# EAGLE design AdelinoR2 (EAGLE 9.2.2)
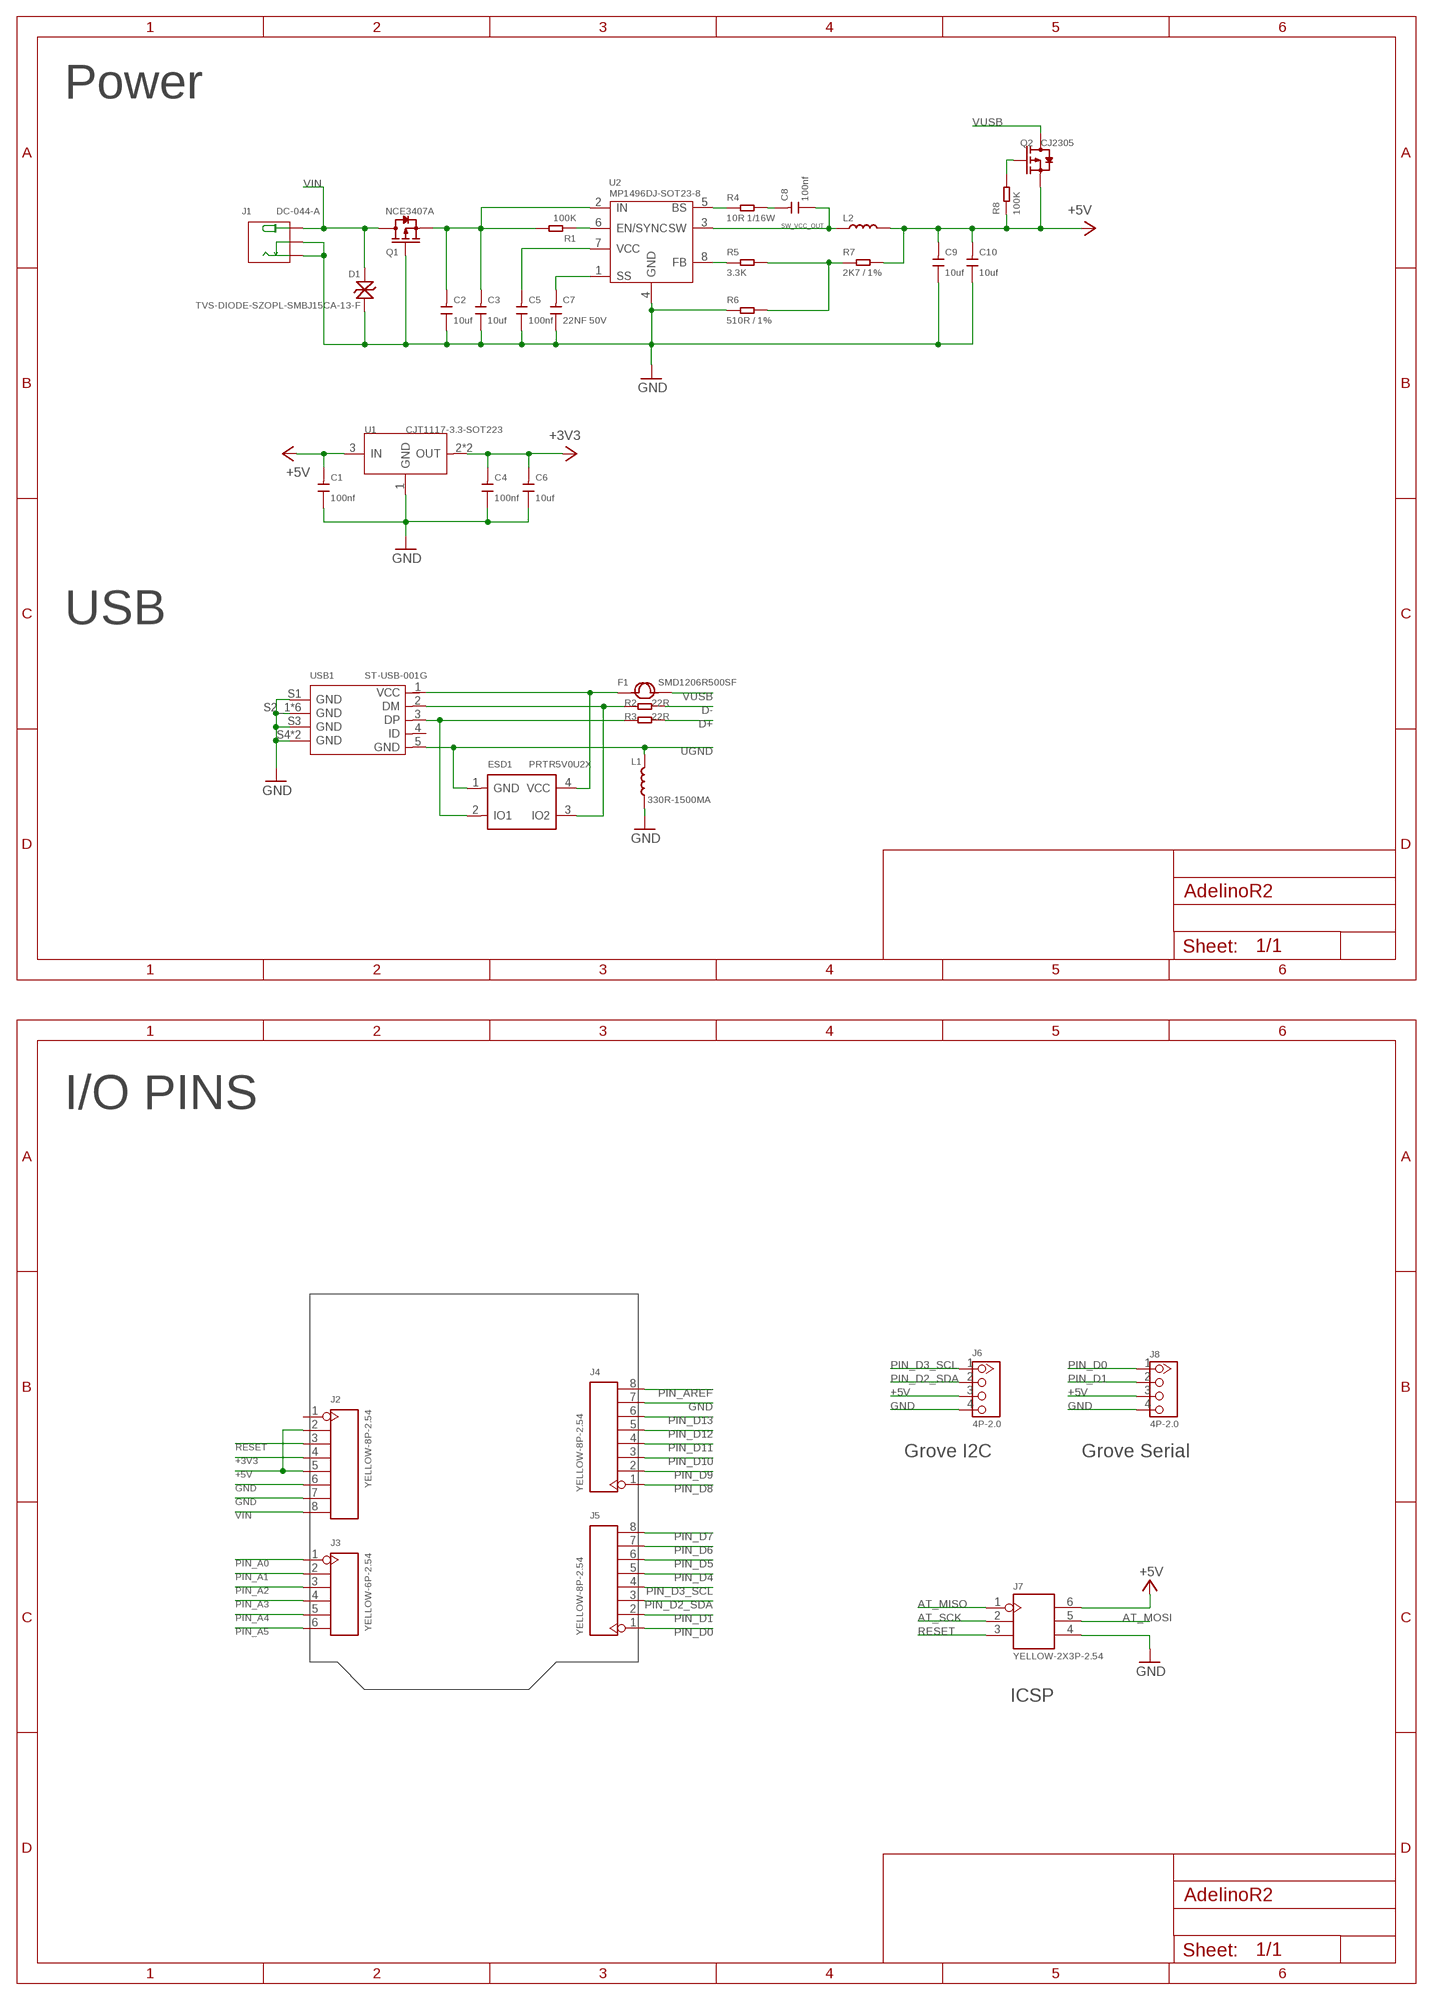
[diagram p0: schematic, sheet 1, part 1 of 2]
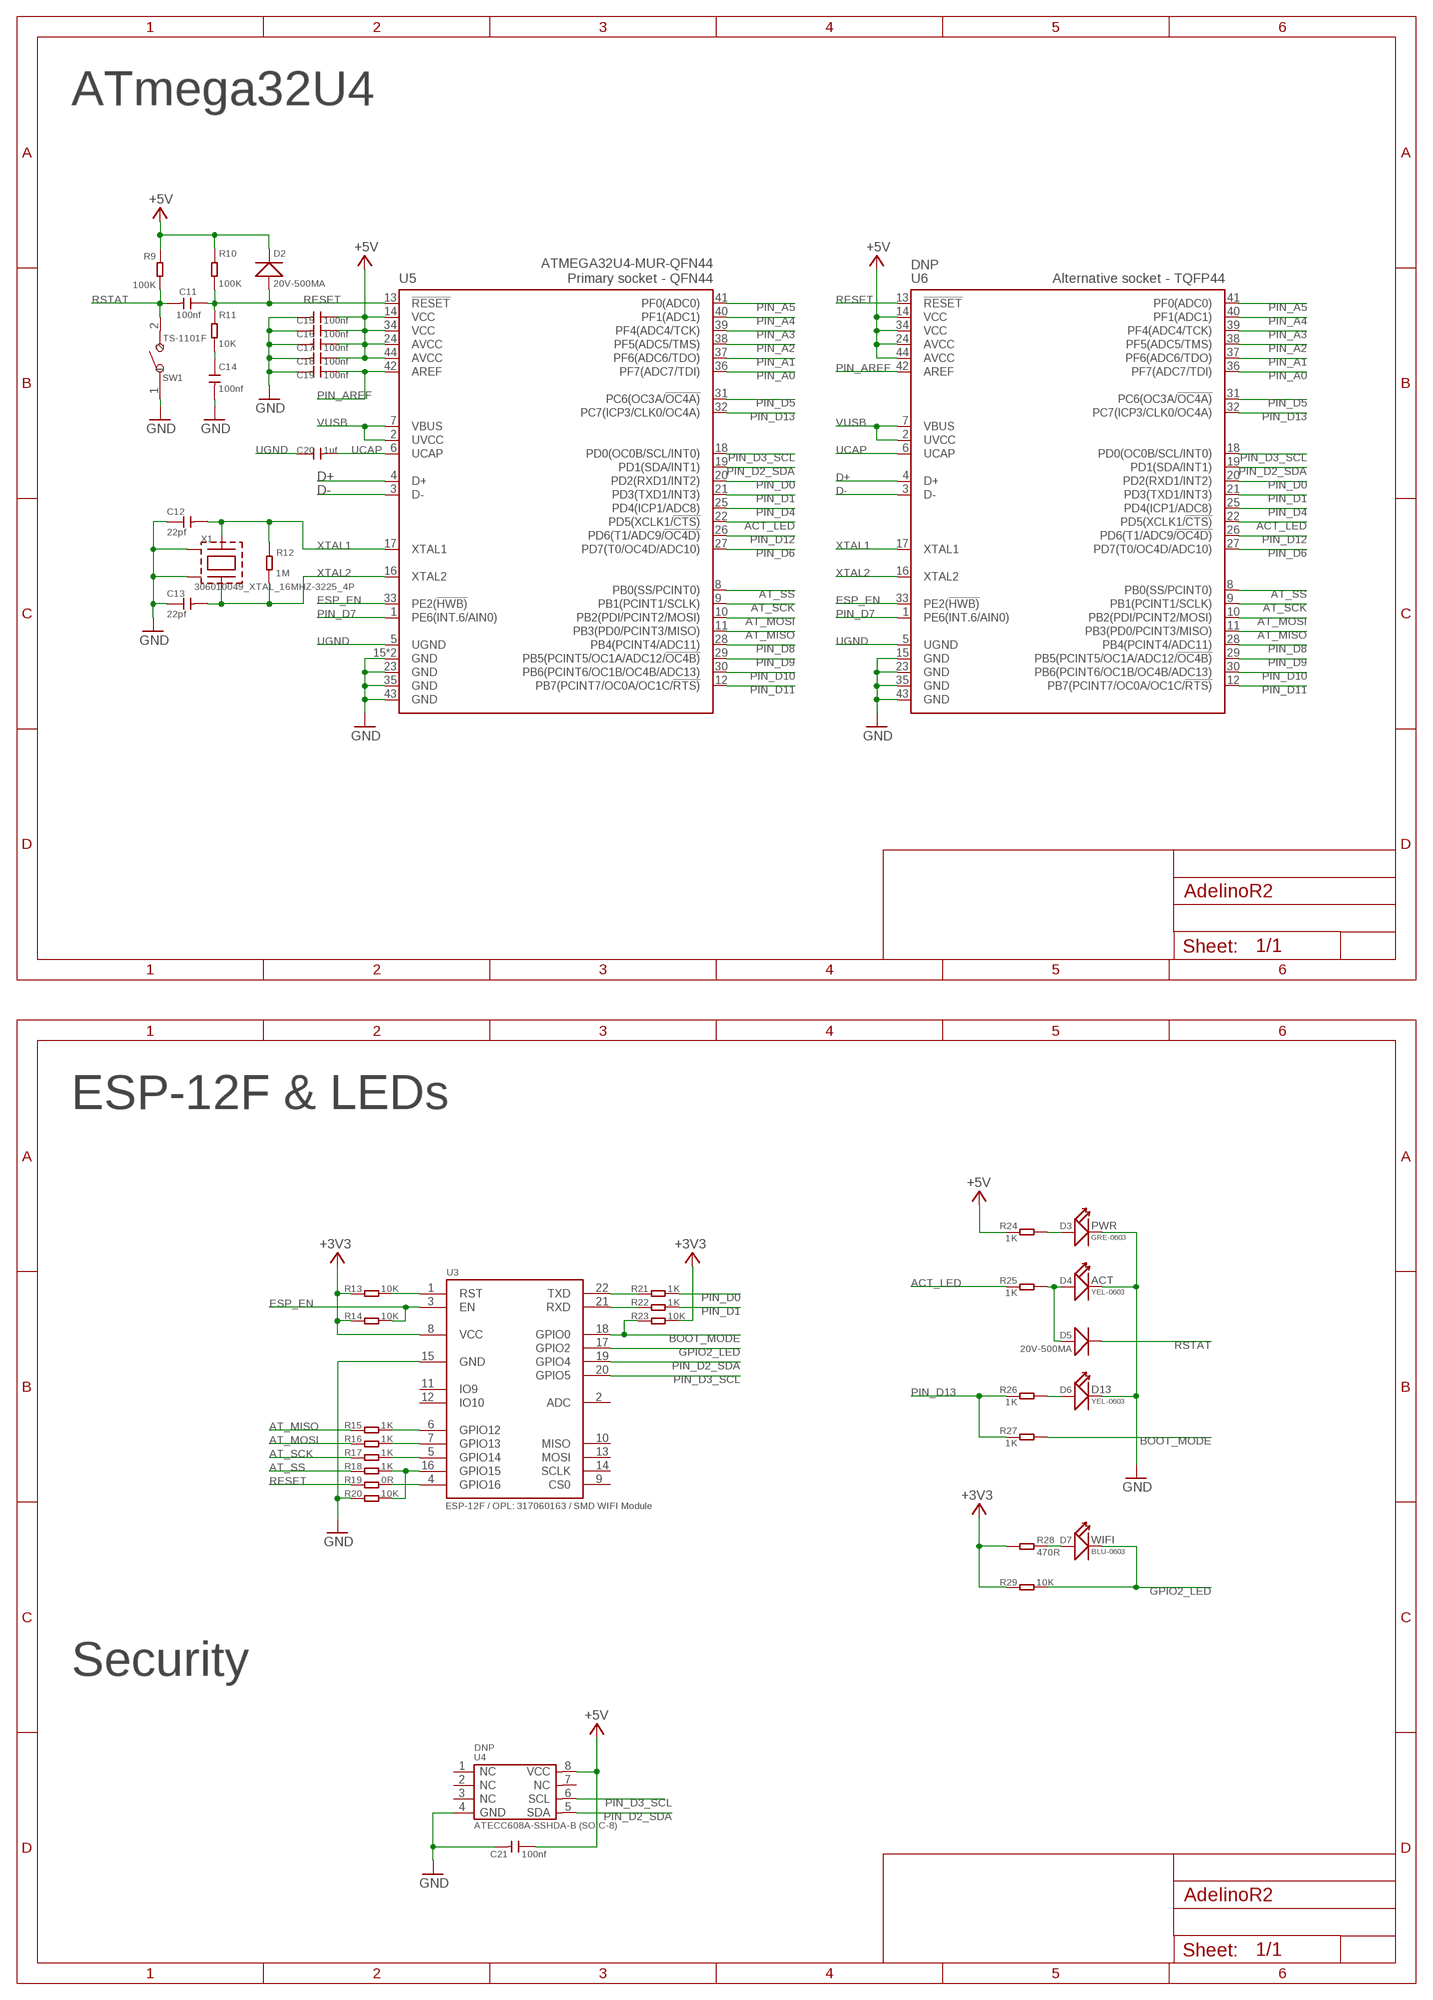
[diagram p1: schematic, sheet 1, part 2 of 2]

## Parts
C1  100nf  CERAMIC-100NF-25V-10%-X7R(0402)  [C0402]
C2  10uf  CERAMIC-10UF-25V-10%-X5R(0805)  [C0805]
C3  10uf  CERAMIC-10UF-25V-10%-X5R(0805)  [C0805]
C4  100nf  CERAMIC-100NF-25V-10%-X7R(0402)  [C0402]
C5  100nf  CERAMIC-100NF-25V-10%-X7R(0402)  [C0402]
C6  10uf  CERAMIC-10UF-25V-10%-X5R(0805)  [C0805]
C7  22NF 50V  CERAMIC-22NF-50V-10%-X7R(0402)  [C0402]
C8  100nf  CERAMIC-100NF-25V-10%-X7R(0402)  [C0402]
C9  10uf  CERAMIC-10UF-25V-10%-X5R(0805)  [C0805]
C10  10uf  CERAMIC-10UF-25V-10%-X5R(0805)  [C0805]
C11  100nf  CERAMIC-100NF-25V-10%-X7R(0402)  [C0402]
C12  22pf  CERAMIC-22PF-50V-5%-NPO(0402)  [C0402]
C13  22pf  CERAMIC-22PF-50V-5%-NPO(0402)  [C0402]
C14  100nf  CERAMIC-100NF-25V-10%-X7R(0402)  [C0402]
C15  100nf  CERAMIC-100NF-25V-10%-X7R(0402)  [C0402]
C16  100nf  CERAMIC-100NF-25V-10%-X7R(0402)  [C0402]
C17  100nf  CERAMIC-100NF-25V-10%-X7R(0402)  [C0402]
C18  100nf  CERAMIC-100NF-25V-10%-X7R(0402)  [C0402]
C19  100nf  CERAMIC-100NF-25V-10%-X7R(0402)  [C0402]
C20  1uf  CERAMIC-1UF-25V-10%-X7R(0805)  [C0805]
C21  100nf  CERAMIC-100NF-25V-10%-X7R(0402)  [C0402]
D1  TVS-DIODE-SZOPL-SMBJ15CA-13-F  [DO-214AA]
D2  20V-500MA  SMD-DIODE-SCHOTTKY-20V-500MA(SOD-123)P  [SOD-123]
D3  GRE-0603  SMD-LED-CLEAR-GREEN(0603)  [LED-0603]
D4  YEL-0603  SMD-LED-CLEAR-YELLOW(0603)  [LED-0603]
D5  20V-500MA  SMD-DIODE-SCHOTTKY-20V-500MA(SOD-123)P  [SOD-123]
D6  YEL-0603  SMD-LED-CLEAR-YELLOW(0603)  [LED-0603]
D7  BLU-0603  SMD-LED-CLEAR-BLUE(0603)  [LED-0603]
ESD1  PRTR5V0U2X  SMD-DIODE-TVS-5.5V  [SOT-143B]
F1  SMD1206R500SF  SMD-PPTC-500MA(1206)  [F1206]
J1  DC-044-A  JACK-DC-044-A  [DCJ3P-11.6X9.6X7.0MM]
J2  YELLOW-8P-2.54  DIP-YELLOW-FEMALE-HEADER(8P-2.54)  [H8-2.54]
J3  YELLOW-6P-2.54  DIP-YELLOW-FEMALE-HEADER-VERT(6P-2.54)  [H6-2.54]
J4  YELLOW-8P-2.54  DIP-YELLOW-FEMALE-HEADER(8P-2.54)  [H8-2.54]
J5  YELLOW-8P-2.54  DIP-YELLOW-FEMALE-HEADER(8P-2.54)  [H8-2.54]
J6  4P-2.0  GROVE-CONNECTOR-DIP(4P-2.0)  [HW4-2.0]
J7  YELLOW-2X3P-2.54  DIP-YELLOW-MALE-HEADER-VERT(2X3P-2.54)  [H2X3-2.54]
J8  4P-2.0  GROVE-CONNECTOR-DIP(4P-2.0)  [HW4-2.0]
L1  330R-1500MA  SMD-FERRITE-BEAD-330R-1500MA(0805)'0805'  [L0805]
L2  10UH-225MA  SMD-INDUCTOR-10UH-20%-2.35A(2P-5X5X4MM)  [L5040S]
Q1  NCE3407A  SMD-MOSFET-P-CH-VDC=30V-ID=4.3A-NCE3407A(SOT-23)  [SOT-23]
Q2  CJ2305  SMD-MOSFET-P-CH-8V-4.1A-CJ2305(SOT-23)  [SOT-23]
R1  100K  SMD-RES-100K-1%-1/16W(0402)  [R0402]
R2  22R  SMD-RES-22R-1%-1/16W(0402)  [R0402]
R3  22R  SMD-RES-22R-1%-1/16W(0402)  [R0402]
R4  10R 1/16W  SMD-RES-10R-1%-1/16W(0402)  [R0402]
R5  3.3K  SMD-RES-3.3K-5%-1/16W(0402)  [R0402]
R6  3K / 1%  SMD-RES-510R-1%-1/10W(0603)  [R0603]
R7  2K7 / 1%  SMD-RES-2.7K-1%-1/10W(0603)  [R0603]
R8  100K  SMD-RES-100K-1%-1/16W(0402)  [R0402]
R9  100K  SMD-RES-100K-1%-1/16W(0402)  [R0402]
R10  100K  SMD-RES-100K-1%-1/16W(0402)  [R0402]
R11  10K  SMD-RES-10K-1%-1/16W(0402)  [R0402]
R12  1M  SMD-RES-1M-1%-1/16W(0402)  [R0402]
R13  10K  SMD-RES-10K-1%-1/16W(0402)  [R0402]
R14  10K  SMD-RES-10K-1%-1/16W(0402)  [R0402]
R15  1K  SMD-RES-1K-5%-1/16W(0402)  [R0402]
R16  1K  SMD-RES-1K-5%-1/16W(0402)  [R0402]
R17  1K  SMD-RES-1K-5%-1/16W(0402)  [R0402]
R18  1K  SMD-RES-1K-5%-1/16W(0402)  [R0402]
R19  0R  SMD-RES-0R-5%-1/16W(0402)  [R0402]
R20  10K  SMD-RES-10K-1%-1/16W(0402)  [R0402]
R21  1K  SMD-RES-1K-5%-1/16W(0402)  [R0402]
R22  1K  SMD-RES-1K-5%-1/16W(0402)  [R0402]
R23  10K  SMD-RES-10K-1%-1/16W(0402)  [R0402]
R24  1K  SMD-RES-1K-5%-1/16W(0402)  [R0402]
R25  1K  SMD-RES-1K-5%-1/16W(0402)  [R0402]
R26  1K  SMD-RES-1K-5%-1/16W(0402)  [R0402]
R27  1K  SMD-RES-1K-5%-1/16W(0402)  [R0402]
R28  470R  SMD-RES-470R-5%-1/16W(0402)  [R0402]
R29  10K  SMD-RES-10K-1%-1/16W(0402)  [R0402]
SW1  TS-1101F  DIP-BUTTON(2P-6.0X3.0X4.3MM)-TS-1101F  [SW2-5.0-6.0X3.0X4.3MM]
U1  CJT1117-3.3-SOT223  PMIC-CJT1117-3.3(SOT223)  [SOT-223]
U2  MP1496DJ-SOT23-8  PMIC-MP1496DJ(SOT23-8)  [SOT-23-8]
U3  ESP-12F / OPL: 317060163 / SMD WIFI Module  ESP-12F  [ESP-12F]
U4  DNP  ATECC608(SOIC8)  [SOIC8-1.27-5X4MM]
U5  ATMEGA32U4-MUR-QFN44  MCU-ATMEGA32U4-MUR(VQFN44)  [QFN44G-0.5-7X7MM]
U6  DNP  MCU-ATMEGA32U4-AU(TQFP44)  [TQFP44-0.8-9.6X9.6MM]
USB1  ST-USB-001G  MICRO-USB-SMD-B-WITHOUT-POST-W/P(ST-USB-001G)  [MICRO-USB5+4P-SMD-0.65-B]
X1  306010049_XTAL_16MHZ-3225_4P  [X3225_4P]

## Nets
+3V3: C4.2 C6.2 J2.4 R13.1 R14.1 R23.2 R28.1 R29.1 U1.2(OUT) U1.TER(OUT) U3.8(VCC)
+5V: C1.2 C9.2 C10.2 C15.1 C16.1 C17.1 C18.1 C21.1 D2.- J2.2 J2.5 J6.3 J7.6 J8.3 L2.2 Q2.2(S) R7.2 R8.1 R9.1 R10.2 R24.1 U1.3(IN) U4.8(VCC) U5.14(VCC) U5.24(AVCC) U5.34(VCC) U5.44(AVCC) U6.14(VCC) U6.24(AVCC) U6.34(VCC) U6.44(AVCC)
_ACT: D4.+ D5.+ R25.2
_D13: D6.+ R26.2
_PWR: D3.+ R24.2
ACT_LED: R25.1 U5.22(PD5(XCLK1/!CTS)) U6.22(PD5(XCLK1/!CTS))
AT_MISO: J7.1 R15.1 U5.11(PB3(PD0/PCINT3/MISO)) U6.11(PB3(PD0/PCINT3/MISO))
AT_MOSI: J7.5 R16.1 U5.10(PB2(PDI/PCINT2/MOSI)) U6.10(PB2(PDI/PCINT2/MOSI))
AT_SCK: J7.2 R17.1 U5.9(PB1(PCINT1/SCLK)) U6.9(PB1(PCINT1/SCLK))
AT_SS: R18.1 U5.8(PB0(SS/PCINT0)) U6.8(PB0(SS/PCINT0))
BOOT_MODE: R23.1 R27.2 U3.18(GPIO0)
D+: R3.2 U5.4(D+) U6.4(D+)
D-: R2.2 U5.3(D-) U6.3(D-)
ESP_EN: R14.2 U3.3(EN) U5.33(PE2(!HWB)) U6.33(PE2(!HWB))
GND: C1.1 C2.1 C3.1 C4.1 C5.1 C6.1 C7.1 C9.1 C10.1 C12.1 C13.1 C14.2 C15.2 C16.2 C17.2 C18.2 C19.2 C21.2 D1.+ D3.- D4.- D6.- J1.CDN1(CDN) J1.CDN2(CDN) J1.CDN3(CDN) J1.CDN4(CDN) J1.GND1(-) J1.GND2(-) J1.GND3(-) J1.GND4(-) J2.6 J2.7 J4.7 J6.4 J7.4 J8.4 L1.1 Q1.1(G) R6.1 R20.1 SW1.1 U1.1(GND) U2.4(GND) U3.15(GND) U4.4(GND) U5.15(GND) U5.23(GND) U5.35(GND) U5.43(GND) U5.TAB(GND) U6.15(GND) U6.23(GND) U6.35(GND) U6.43(GND) USB1.S1(GND) USB1.S2_1(GND) USB1.S2_2(GND) USB1.S2_3(GND) USB1.S3(GND) USB1.S4(GND) USB1.S5_1(GND) USB1.S5_2(GND) USB1.S5_3(GND) USB1.S6(GND) X1.P$2(GND1) X1.P$4(GND2)
GPIO2_LED: D7.- R29.2 U3.17(GPIO2)
N$1 [usb]: ESD1.3(IO2) R2.1 USB1.2(DM)
N$2 [usb]: ESD1.2(IO1) R3.1 USB1.3(DP)
N$3: Q2.1(G) R8.2
N$4: D7.+ R28.2
N$5: R19.2 U3.4(GPIO16)
N$9: ESD1.4(VCC) F1.1 USB1.1(VCC)
N$12: R15.2 U3.6(GPIO12)
N$13: C14.1 R11.2
N$14: R16.2 U3.7(GPIO13)
N$15: C8.2 R4.2
N$17: R21.1 U3.22(TXD)
N$18: R22.1 U3.21(RXD)
N$19: R17.2 U3.5(GPIO14)
N$20: R18.2 R20.2 U3.16(GPIO15)
N$22: R13.2 U3.1(RST)
N$23: R5.2 R6.2 R7.1
PIN_A0: J3.1 U5.36(PF7(ADC7/TDI)) U6.36(PF7(ADC7/TDI))
PIN_A1: J3.2 U5.37(PF6(ADC6/TDO)) U6.37(PF6(ADC6/TDO))
PIN_A2: J3.3 U5.38(PF5(ADC5/TMS)) U6.38(PF5(ADC5/TMS))
PIN_A3: J3.4 U5.39(PF4(ADC4/TCK)) U6.39(PF4(ADC4/TCK))
PIN_A4: J3.5 U5.40(PF1(ADC1)) U6.40(PF1(ADC1))
PIN_A5: J3.6 U5.41(PF0(ADC0)) U6.41(PF0(ADC0))
PIN_AREF: C19.1 J4.8 U5.42(AREF) U6.42(AREF)
PIN_D0: J5.1 J8.1 R21.2 U5.20(PD2(RXD1/INT2)) U6.20(PD2(RXD1/INT2))
PIN_D1: J5.2 J8.2 R22.2 U5.21(PD3(TXD1/INT3)) U6.21(PD3(TXD1/INT3))
PIN_D2_SDA: J5.3 J6.2 U3.19(GPIO4) U4.5(SDA) U5.19(PD1(SDA/INT1)) U6.19(PD1(SDA/INT1))
PIN_D3_SCL: J5.4 J6.1 U3.20(GPIO5) U4.6(SCL) U5.18(PD0(OC0B/SCL/INT0)) U6.18(PD0(OC0B/SCL/INT0))
PIN_D4: J5.5 U5.25(PD4(ICP1/ADC8)) U6.25(PD4(ICP1/ADC8))
PIN_D5: J5.6 U5.31(PC6(OC3A/!OC4A)) U6.31(PC6(OC3A/!OC4A))
PIN_D6: J5.7 U5.27(PD7(T0/OC4D/ADC10)) U6.27(PD7(T0/OC4D/ADC10))
PIN_D7: J5.8 U5.1(PE6(INT.6/AIN0)) U6.1(PE6(INT.6/AIN0))
PIN_D8: J4.1 U5.28(PB4(PCINT4/ADC11)) U6.28(PB4(PCINT4/ADC11))
PIN_D9: J4.2 U5.29(PB5(PCINT5/OC1A/ADC12/!OC4B)) U6.29(PB5(PCINT5/OC1A/ADC12/!OC4B))
PIN_D10: J4.3 U5.30(PB6(PCINT6/OC1B/OC4B/ADC13)) U6.30(PB6(PCINT6/OC1B/OC4B/ADC13))
PIN_D11: J4.4 U5.12(PB7(PCINT7/OC0A/OC1C/!RTS)) U6.12(PB7(PCINT7/OC0A/OC1C/!RTS))
PIN_D12: J4.5 U5.26(PD6(T1/ADC9/!OC4D)) U6.26(PD6(T1/ADC9/!OC4D))
PIN_D13: J4.6 R26.1 R27.1 U5.32(PC7(ICP3/CLK0/OC4A)) U6.32(PC7(ICP3/CLK0/OC4A))
RESET: C11.1 D2.+ J2.3 J7.3 R10.1 R11.1 R19.1 U5.13(!RESET) U6.13(!RESET)
RSTAT: C11.2 D5.- R9.2 SW1.2
SW_BS: R4.1 U2.5(BS)
SW_EN: R1.1 U2.6(EN/SYNC)
SW_FB: R5.1 U2.8(FB)
SW_SS: C7.2 U2.1(SS)
SW_VCAP: C5.2 U2.7(VCC)
SW_VCC_IN: C2.2 C3.2 Q1.2(S) R1.2 U2.2(IN)
SW_VCC_OUT: C8.1 L2.1 U2.3(SW)
UCAP: C20.2 U5.6(UCAP) U6.6(UCAP)
UGND: C20.1 ESD1.1(GND) L1.2 U5.5(UGND) U6.5(UGND) USB1.5(GND)
VIN: D1.- J1.VCC1(+) J1.VCC2(+) J1.VCC3(+) J1.VCC4(+) J2.8 Q1.3(D)
VUSB: F1.2 Q2.3(D) U5.2(UVCC) U5.7(VBUS) U6.2(UVCC) U6.7(VBUS)
XTAL1: C12.2 R12.2 U5.17(XTAL1) U6.17(XTAL1) X1.P$1
XTAL2: C13.2 R12.1 U5.16(XTAL2) U6.16(XTAL2) X1.P$3
Unconnected: J2.1 U3.2(ADC) U3.9(CS0) U3.10(MISO) U3.11(IO9) U3.12(IO10) U3.13(MOSI) U3.14(SCLK) U4.1(NC1) U4.2(NC2) U4.3(NC3) U4.7(NC4) USB1.4(ID)

## Notes on the sheet
- Power | ATmega32U4
- USB
- I/O PINS | ESP-12F & LEDs
- Grove I2C | Grove Serial
- Security
- ICSP

## Library data of the parts
C1 C4 C5 C8 C11 C14-C19 C21 = Seeed-Capacitor:CERAMIC-100NF-25V-10%-X7R(0402): 302010024; MPN: CC0402KRX7R8BB104
C2 C3 C6 C9 C10 = Seeed-Capacitor:CERAMIC-10UF-25V-10%-X5R(0805): 302010178; MPN: CC0805KKX5R8BB106
C7 = Seeed-Capacitor:CERAMIC-22NF-50V-10%-X7R(0402): 302010242; MPN: CC0402KRX7R9BB223
C12 C13 = Seeed-Capacitor:CERAMIC-22PF-50V-5%-NPO(0402): 302010018; MPN: CC0402JRNPO9BN220
C20 = Seeed-Capacitor:CERAMIC-1UF-25V-10%-X7R(0805): 302010179; MPN: CC0805KKX7R8BB105
D1 = Adelino-Misc:TVS-DIODE-SZOPL-SMBJ15CA-13-F: SMD Diode TVS 24VWM/38.9VC-600W;DO-214AA(SMB); MPN: SMBJ15CA-13-F; SKU: SHENZHEN-OPL;TVS DIODE 15VWM 24.4VC SMB
D2 D5 = Seeed-Diode:SMD-DIODE-SCHOTTKY-20V-500MA(SOD-123)P: 304020028; MPN: MBR0520LT1G
D3 = Seeed-LED:SMD-LED-CLEAR-GREEN(0603): 304090043; LABEL: PWR; MPN: 19-217-G7C-AN1P2-3T; VALUE: GREEN-0603
D4 = Seeed-LED:SMD-LED-CLEAR-YELLOW(0603): 304090044; LABEL: ACT; MPN: 19-217-Y5C-AM1N1VY-3T; VALUE: YELLOW-0603
D6 = Seeed-LED:SMD-LED-CLEAR-YELLOW(0603): 304090044; LABEL: D13; MPN: 19-217-Y5C-AM1N1VY-3T; VALUE: YELLOW-0603
D7 = Seeed-LED:SMD-LED-CLEAR-BLUE(0603): 304090045; LABEL: WIFI; MPN: 19-217-BHC-ZL1M2RY-3T; VALUE: BLUE-0603
ESD1 = Seeed-OPL-2017-01-Diode-james:SMD-DIODE-TVS-5.5V: SMD Diode TVS;5.5V; MPN: NXP;PRTR5V0U2X,215; SKU: 304050022
F1 = Seeed-Fuse:SMD-PPTC-500MA(1206): 307010002; MPN: SMD1206R500SF
J1 = Seeed-Connector:JACK-DC-044-A: 320120002; MPN: JACK-DC-044-A
J2 J4 J5 = Seeed-Connector:DIP-YELLOW-FEMALE-HEADER(8P-2.54): 320030065; MPN: F185-1108A1BSYC1
J3 = Seeed-Connector:DIP-YELLOW-FEMALE-HEADER-VERT(6P-2.54): 320030019; MPN: F185-1106A1BSYA3
J6 J8 = Seeed-Connector:GROVE-CONNECTOR-DIP(4P-2.0): 320110033
J7 = Seeed-Connector:DIP-YELLOW-MALE-HEADER-VERT(2X3P-2.54): 320020027; MPN: P125-1203A0BS116A2
L1 = Seeed-Inductor:SMD-FERRITE-BEAD-330R-1500MA(0805): 303030006; MPN: BLM21PG331SN1D
L2 = Seeed-Inductor:SMD-INDUCTOR-10UH-20%-2.35A(2P-5X5X4MM): 303010147
Q1 = Seeed-Transistor:SMD-MOSFET-P-CH-VDC=30V-ID=4.3A-NCE3407A(SOT-23): 305030010; MPN: NCE3407A
Q2 = Seeed-Transistor:SMD-MOSFET-P-CH-8V-4.1A-CJ2305(SOT-23): 305030014; MPN: CJ2305
R1 R8-R10 = Seeed-Resistor:SMD-RES-100K-1%-1/16W(0402): 301010456; MPN: RC0402FR-07100KL
R2 R3 = Seeed-Resistor:SMD-RES-22R-1%-1/16W(0402): 301010052; MPN: RC0402FR-0722RL
R4 = Seeed-Resistor:SMD-RES-10R-1%-1/16W(0402): 301010444; MPN: RC0402FR-0710RL
R5 = Seeed-Resistor:SMD-RES-3.3K-5%-1/16W(0402): 301010035; MPN: RC0402JR-073K3L
R6 = Seeed-Resistor:SMD-RES-510R-1%-1/10W(0603): 301010215; R: 510R / 1%
R7 = Seeed-Resistor:SMD-RES-2.7K-1%-1/10W(0603): 301010193; R: 2K7 / 1%
R11 R13 R14 R20 R23 R29 = Seeed-Resistor:SMD-RES-10K-1%-1/16W(0402): 301010047; MPN: RC0402FR-0710KL; VALUE: 10K 1/16W
R12 = Seeed-Resistor:SMD-RES-1M-1%-1/16W(0402): 301010043; MPN: RC0402FR-071ML
R15-R18 R21 R22 R24-R27 = Seeed-Resistor:SMD-RES-1K-5%-1/16W(0402): 301010006; MPN: RC0402JR-071KL
R19 = Seeed-Resistor:SMD-RES-0R-5%-1/16W(0402): 301010000; MPN: RC0402JR-070RL
R28 = Seeed-Resistor:SMD-RES-470R-5%-1/16W(0402): 301010013; MPN: RC0402JR-07470RL; VALUE: 470R 1/16W
SW1 = Seeed-Switch:DIP-BUTTON(2P-6.0X3.0X4.3MM): 311020025; MPN: TS-1101F
U1 = Seeed-IC:PMIC-CJT1117-3.3(SOT223): 310030097; MPN: CJT1117-3.3
U2 = Seeed-IC:PMIC-MP1496DJ(SOT23-8): 310030121; MPN: MP1496DJ
U3 = Seeed-OPL-2017-01-Sensor-camilo:ESP-12F: 317060163
U4 = Adelino-Misc:ATECC608(SOIC8): ATECC608; DESC: ATECC608A-SSHDA-B (SOIC-8); MOUSER_REF: https://www.mouser.com/ProductDetail/556-ATECC608ASSHDAB; MPN: ATECC608A-SSHDA-B; VALUE: ATECC608-SOIC8
U5 = Seeed-IC:MCU-ATMEGA32U4-MUR(VQFN44): 310010016; DESC: Primary socket - QFN44; MPN: ATMEGA32U4-MUR
U6 = Seeed-IC:MCU-ATMEGA32U4-AU(TQFP44): 310010010; DESC: Alternative socket - TQFP44; MPN: ATMEGA32U4; VALUE: ATMEGA32U4-TQFP44
USB1 = Seeed-Connector:MICRO-USB-SMD-B-WITHOUT-POST-W/P(ST-USB-001G): 320010000; MPN: ST-USB-001G
X1 = Seeed-OPL-2017-01-Crystal-Akita:306010049_XTAL_16MHZ-3225_4P: SMD Crystal 16MHz-9pF-10ppm-40R;4P-L3.2*W2.5mm, SKU: 306010049

## Net classes
0 default: width 0.203 mm, drill 0.203 mm, clearance 0.254 mm
1 usb: width 0.203 mm, clearance 0.203 mm

## Board
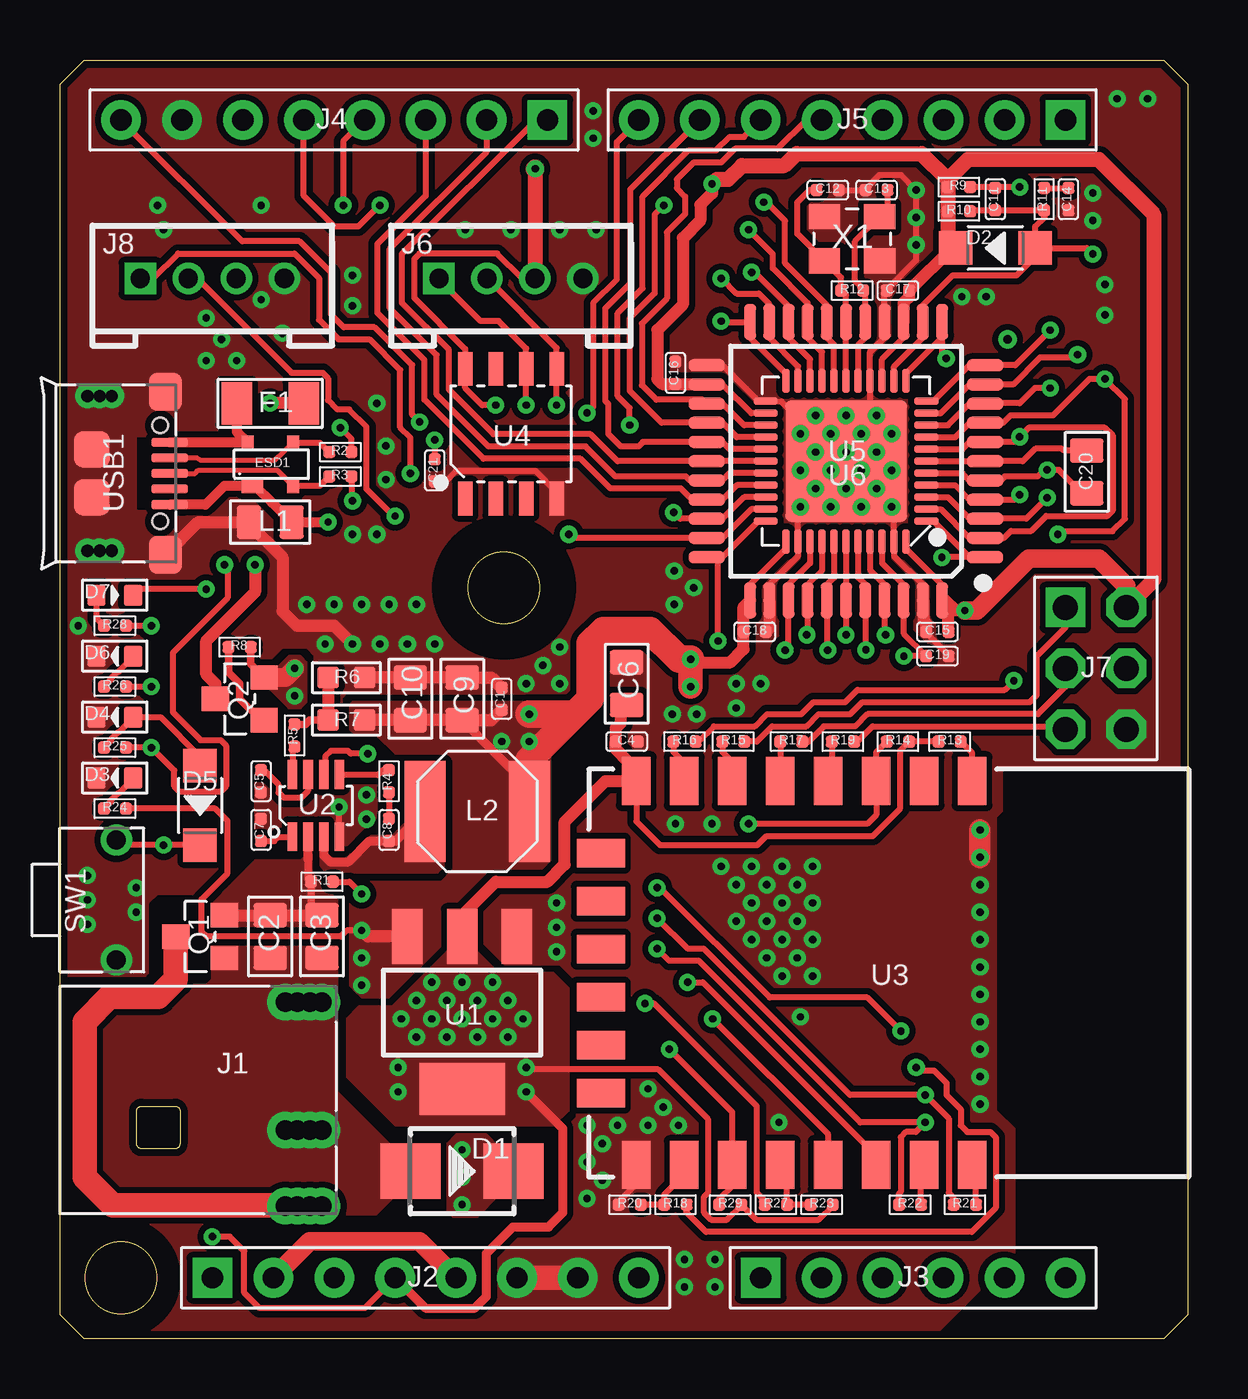
[diagram p2: board, top side]
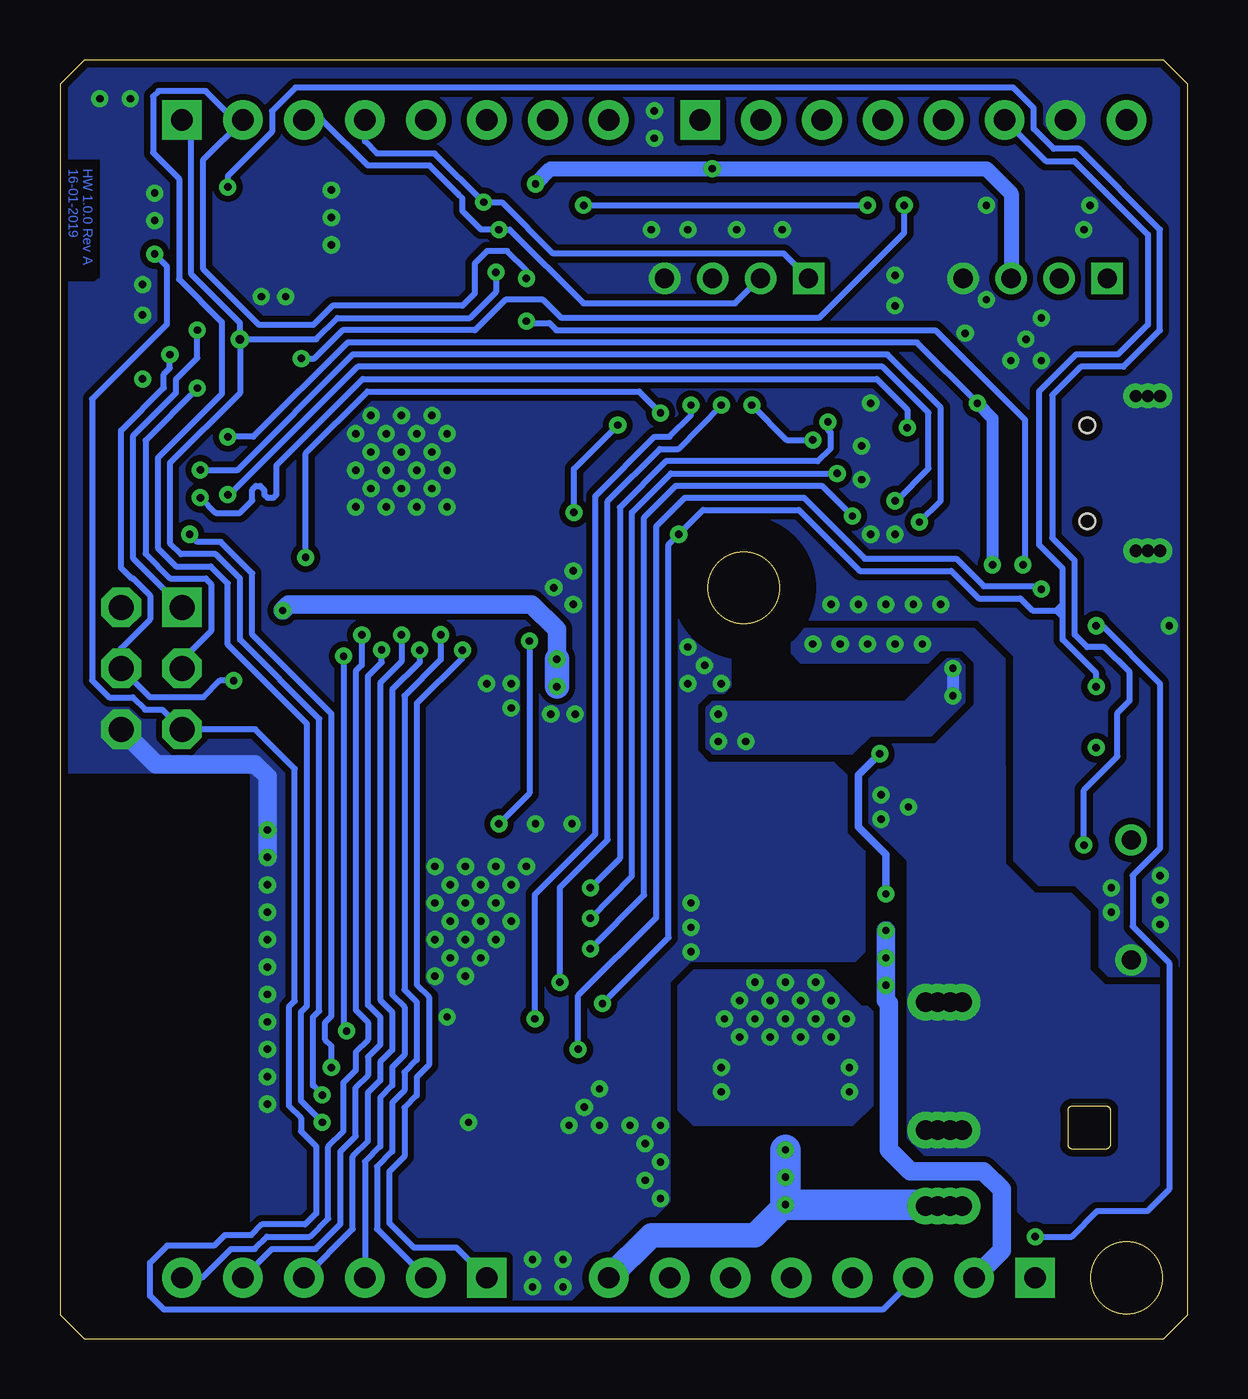
[diagram p3: board, bottom side, seen from below]

Size 47 x 53.3 mm. Coordinates in mm from the lower left corner, seen from the top.
Outline: 0,1 0,52.3 1,53.3 46,53.3 47,52.3 47,1 46,0 1,0 0,1
Outline: circle at 2.54,2.54 radius 1.5
Outline: circle at 18.5,31.3 radius 1.5
Copper layers (1*16): Top 0.035mm / dielectric 1.5mm / Bottom 0.035mm
Design rules "Adelino_SeeedStudio_defaults": minimum track width 6mil, minimum drill 12mil, track to track 6mil, track to pad 6mil, pad to pad 6mil, via to via 8mil, smd to smd 6mil, copper to edge 12mil, drill to drill 12mil, minimum pad ring 10mil, minimum via ring 8mil, stop-mask expansion 2mil, vias tented up to drill 0mil, thermal gap 10mil
tKeepout: area 0.5,0.5 to 4.5,4.5; area 16.2,29.1 to 20.8,33.5; area 39.1,3.9 to 47,23.5
bKeepout: area 16.2,29.1 to 20.8,33.5; area 0.5,0.5 to 4.5,4.5; area 39.1,4.3 to 47,23.5
tRestrict: area 0.5,0.5 to 4.5,4.5; area 16.2,29.1 to 20.8,33.5; area 39.1,3.6 to 47,23.7
bRestrict: area 0.5,0.5 to 4.5,4.5; area 16.2,29.1 to 20.8,33.5; area 39.1,4.2 to 47,23.5; area 45.3,44.2 to 46.9,49.1

### Footprints (pad centres in the part's own frame; a part is rotated, then mirrored left to right if it is on the bottom)
C0402 = smd 0.5 x 0.5: 1 0,0.463; 2 0,-0.463
C0805 = smd 1.397 x 1.016: 1 0,0.889; 2 0,-0.889
DO-214AA = smd 2.5 x 2.3: + -2.15,0; - 2.15,0
SOD-123 = smd 1.397 x 1.397: + -1.651,0; - 1.651,0
LED-0603 = smd 0.762 x 0.889: + -0.762,0; - 0.762,0
SOT-143B = smd 0.9 x 0.6: 1 -0.75,-0.9 | smd 0.5 x 0.6: 2 0.95,-0.9; 3 0.95,0.9; 4 -0.95,0.9
F1206 = smd 1.27 x 1.778: 1 -1.397,0; 2 1.397,0
DCJ3P-11.6X9.6X7.0MM = drill 0.813 pad 1.524: CDN1 1.206,10.922; CDN2 1.206,10.414; CDN3 1.206,9.906; CDN4 1.206,9.398; GND1 -4.128,10.922; GND2 -4.128,10.414; GND3 -4.128,9.906; GND4 -4.128,9.398; VCC1 4.381,10.922; VCC2 4.381,10.414; VCC3 4.381,9.906; VCC4 4.381,9.398
H8-2.54 = drill 0.889 pad 1.651 square: 1 0,8.89 | drill 0.889 pad 1.651: 2 0,6.35; 3 0,3.81; 4 0,1.27; 5 0,-1.27; 6 0,-3.81; 7 0,-6.35; 8 0,-8.89
H6-2.54 = drill 0.889 pad 1.651 square: 1 0,6.35 | drill 0.889 pad 1.651: 2 0,3.81; 3 0,1.27; 4 0,-1.27; 5 0,-3.81; 6 0,-6.35
HW4-2.0 = drill 0.8 pad 1.27 square: 1 -3,0 | drill 0.8 pad 1.27: 2 -1,0; 3 1,0; 4 3,0
H2X3-2.54 = drill 1.041 pad 1.651 square: 1 -1.27,2.54 | drill 1.041 pad 1.651 octagon: 2 -1.27,0; 3 -1.27,-2.54; 4 1.27,-2.54; 5 1.27,0; 6 1.27,2.54
L0805 = smd 1.016 x 1.397: 1 -0.889,0; 2 0.889,0
L5040S = smd 4.2 x 1.7: 1 0,2.175; 2 0,-2.175
SOT-23 = smd 1.016 x 1.143: 1 -0.889,-1.016; 2 0.889,-1.016; 3 0,1.016
R0402 = smd 0.5 x 0.5: 1 0,0.463; 2 0,-0.463
R0603 = smd 0.889 x 0.889: 1 0,0.762; 2 0,-0.762
SW2-5.0-6.0X3.0X4.3MM = drill 0.8 pad 1.27: 1 -2.5,0; 2 2.5,0
SOT-223 = smd 1.27 x 2.286: 1 -2.286,-3.175; 2 0,-3.175; 3 2.286,-3.175 | smd 3.556 x 2.159: TER 0,3.175
SOT-23-8 = smd 0.4 x 1.2: 1 -0.975,-1.3; 2 -0.325,-1.3; 3 0.325,-1.3; 4 0.975,-1.3; 5 0.975,1.3; 6 0.325,1.3; 7 -0.325,1.3; 8 -0.975,1.3
ESP-12F = smd 2 x 1.2: 1 -8,3.48; 2 -8,1.48; 3 -8,-0.52; 4 -8,-2.52; 5 -8,-4.52; 6 -8,-6.52; 7 -8,-8.52; 8 -8,-10.52; 15 8,-10.52; 16 8,-8.52; 17 8,-6.52; 18 8,-4.52; 19 8,-2.52; 20 8,-0.52; 21 8,1.48; 22 8,3.48 | smd 1.2 x 2: 9 -5,-12; 10 -3,-12; 11 -1,-12; 12 1,-12; 13 3,-12; 14 5,-12
SOIC8-1.27-5X4MM = smd 0.6 x 1.4: 1 -1.905,-2.7; 2 -0.635,-2.7; 3 0.635,-2.7; 4 1.905,-2.7; 5 1.905,2.7; 6 0.635,2.7; 7 -0.635,2.7; 8 -1.905,2.7
QFN44G-0.5-7X7MM = smd 1 x 0.3: 1 -3.35,2.5; 2 -3.35,2; 3 -3.35,1.5; 4 -3.35,1; 5 -3.35,0.5; 6 -3.35,0; 7 -3.35,-0.5; 8 -3.35,-1; 9 -3.35,-1.5; 10 -3.35,-2; 11 -3.35,-2.5; 23 3.35,-2.5; 24 3.35,-2; 25 3.35,-1.5; 26 3.35,-1; 27 3.35,-0.5; 28 3.35,0; 29 3.35,0.5; 30 3.35,1; 31 3.35,1.5; 32 3.35,2; 33 3.35,2.5 | smd 0.3 x 1: 12 -2.5,-3.35; 13 -2,-3.35; 14 -1.5,-3.35; 15 -1,-3.35; 16 -0.5,-3.35; 17 0,-3.35; 18 0.5,-3.35; 19 1,-3.35; 20 1.5,-3.35; 21 2,-3.35; 22 2.5,-3.35; 34 2.5,3.35; 35 2,3.35; 36 1.5,3.35; 37 1,3.35; 38 0.5,3.35; 39 0,3.35; 40 -0.5,3.35; 41 -1,3.35; 42 -1.5,3.35; 43 -2,3.35; 44 -2.5,3.35 | smd 5.08 x 5.08: TAB 0,0
TQFP44-0.8-9.6X9.6MM = smd 1.5 x 0.5: 1 -5.8,4; 2 -5.8,3.2; 3 -5.8,2.4; 4 -5.8,1.6; 5 -5.8,0.8; 6 -5.8,0; 7 -5.8,-0.8; 8 -5.8,-1.6; 9 -5.8,-2.4; 10 -5.8,-3.2; 11 -5.8,-4; 23 5.8,-4; 24 5.8,-3.2; 25 5.8,-2.4; 26 5.8,-1.6; 27 5.8,-0.8; 28 5.8,0; 29 5.8,0.8; 30 5.8,1.6; 31 5.8,2.4; 32 5.8,3.2; 33 5.8,4 | smd 0.5 x 1.5: 12 -4,-5.8; 13 -3.2,-5.8; 14 -2.4,-5.8; 15 -1.6,-5.8; 16 -0.8,-5.8; 17 0,-5.8; 18 0.8,-5.8; 19 1.6,-5.8; 20 2.4,-5.8; 21 3.2,-5.8; 22 4,-5.8; 34 4,5.8; 35 3.2,5.8; 36 2.4,5.8; 37 1.6,5.8; 38 0.8,5.8; 39 0,5.8; 40 -0.8,5.8; 41 -1.6,5.8; 42 -2.4,5.8; 43 -3.2,5.8; 44 -4,5.8
MICRO-USB5+4P-SMD-0.65-B = smd 0.381 x 1.524: 1 -1.3,-0.25; 2 -0.65,-0.25; 3 0,-0.25; 4 0.65,-0.25; 5 1.3,-0.25 | smd 1.6 x 1.397: S1 -3.4,-0.427; S6 3.4,-0.427 | drill 0.508 pad 1.016: S2_1 -3.226,-3.683; S2_2 -3.226,-3.175; S2_3 -3.226,-2.667; S5_1 3.226,-3.683; S5_2 3.226,-3.175; S5_3 3.226,-2.667 | smd 1.5 x 1.5: S3 -1,-3.5; S4 1,-3.5 | hole 0.635: -2,-0.65; 2,-0.65
X3225_4P = smd 1.3 x 1.05: P$1 -1.15,-0.925; P$2 1.15,-0.925; P$3 1.15,0.925; P$4 -1.15,0.925

### Placement (x,y rotation side)
C1  18.41,26.67 0 top
C2  8.76,16.76 180 top
C3  10.92,16.76 180 top
C4  23.62,24.89 270 top
C5  8.38,23.24 180 top
C6  23.62,27.3 0 top
C7  8.38,21.21 0 top
C8  13.72,21.21 180 top
C9  16.76,26.67 0 top
C10  14.61,26.67 0 top
C11  38.99,47.5 180 top
C12  32,47.88 270 top
C13  34.04,47.88 90 top
C14  42.04,47.5 0 top
C15  36.58,29.46 270 top
C16  25.65,40.26 180 top
C17  34.92,43.69 270 top
C18  28.96,29.46 90 top
C19  36.58,28.45 90 top
C20  42.8,36.13 180 top
C21  15.62,36.2 0 top
D1  16.76,6.99 0 top
D2  38.99,45.47 180 top
D3  2.29,23.37 180 top
D4  2.29,25.91 180 top
D5  5.84,22.23 270 top
D6  2.29,28.45 180 top
D7  2.29,30.99 0 top
ESD1  8.76,36.45 0 top
F1  8.76,38.99 0 top
J1  0,9.91 270 top
J2  15.24,2.54 90 top
J3  35.56,2.54 90 top
J4  11.43,50.8 270 top
J5  33.02,50.8 270 top
J6  18.8,44.2 0 top
J7  43.18,27.94 0 top
J8  6.35,44.2 0 top
L1  8.76,34.04 0 top
L2  17.4,21.97 90 top
Q1  5.84,16.76 90 top
Q2  7.49,26.67 90 top
R1  10.92,19.05 270 top
R2  11.68,36.96 90 top
R3  11.68,35.94 90 top
R4  13.72,23.24 0 top
R5  9.78,25.15 180 top
R6  11.94,27.56 270 top
R7  11.94,25.78 90 top
R8  7.49,28.83 270 top
R9  37.47,48.01 90 top
R10  37.47,46.99 270 top
R11  41.02,47.5 180 top
R12  33.02,43.69 270 top
R13  37.08,24.89 90 top
R14  34.92,24.89 270 top
R15  28.07,24.89 270 top
R16  26.04,24.89 270 top
R17  30.48,24.89 270 top
R18  25.65,5.59 270 top
R19  32.64,24.89 270 top
R20  23.75,5.59 90 top
R21  37.72,5.59 270 top
R22  35.43,5.59 270 top
R23  31.75,5.59 90 top
R24  2.29,22.1 270 top
R25  2.29,24.64 270 top
R26  2.29,27.18 270 top
R27  29.84,5.59 90 top
R28  2.29,29.72 270 top
R29  27.94,5.59 270 top
SW1  2.35,18.29 90 top
U1  16.76,13.59 180 top
U2  10.67,22.23 0 top
U3  34.54,15.24 270 top
U4  18.8,37.72 0 top
U5  32.77,36.58 180 top
U6  32.77,36.58 180 top
USB1  4.83,36.07 270 top
X1  33.02,45.85 0 top

### Tracks (layer width: path | path; a pad name or v marks a point on that pad's centre or on a via)
+3V3  (via drill 0.3 pad 0.64)
  Top 0.254: R13.1 R14.1 35.03,24.51 35.03,22.1 33.88,20.95 29.45,20.95 29.07,20.57 25.02,20.57 24.02,21.57 U3.8 | J2.4 12.71,1.27 8.32,1.27 7.68,1.91 7.68,3.65 7.08,4.25 v6.35,4.25 | R28.1 v3.81,29.72 | R23.2 32.21,5.55 31.62,4.96 29.03,4.96 R29.1 28.4,5.55 27.81,4.96 27.14,4.96 26.85,5.25 26.85,5.92 27,6.08 27,9.16 24.94,11.22 19.51,11.22 v19.43,11.3
  Top 0.381: J2.4 15.24,1.27 17.29,1.27 17.78,1.76 17.78,3.56 18.89,4.66 20.36,4.66 20.95,5.25 20.95,8.76 v19.43,10.29
  Top 0.508: U1.2 16.76,17.65 18.16,19.05 20.32,19.05 21.04,19.77 21.04,21.54 22.73,23.24 U3.8 23.75,23.52 23.75,24 23.16,24.59 C4.2 23.16,25.45 23.37,25.65 23.37,26.16 C6.2
  Bottom 0.254: v6.35,4.25 4.83,4.25 3.78,5.31 1.68,5.31 0.76,6.23 0.76,15.66 2.29,17.19 2.29,19.3 1.15,20.44 1.15,27.31 3.56,29.72 v3.81,29.72
  other vias: 15.49,14.86 14.86,14.1 14.22,13.34 14.1,10.29 18.67,12.57 19.3,13.34 18.67,14.1 18.03,14.86 16.76,14.86 14.1,11.3 16.13,14.1 17.4,14.1 15.49,13.34 16.76,13.34 18.03,13.34 14.86,12.57 16.13,12.57 17.4,12.57
  pour Top (no thermals): 11.94,13.34 11.94,10.92 13.97,8.89 20.57,8.89 21.21,9.53 21.21,14.61 20.57,15.24 18.29,15.24 17.02,16.51 16.51,16.51 13.84,13.84 12.45,13.84
  pour Bottom: 13.08,13.59 13.08,9.78 13.97,8.89 20.57,8.89 21.21,9.53 21.21,14.73 20.57,15.37 15.11,15.37 13.59,13.84 13.34,13.84
+5V  (via drill 0.3 pad 0.64)
  Top 0.254: U5.34 30.27,32.93 28.77,31.43 U6.34 | U5.44 35.27,32.93 36.77,31.43 U6.44 | U5.14 34.27,40.83 35.17,41.73 U6.14 | U5.24 28.82,38.58 27.62,39.78 U6.24 | 35.43,43.69 C17.1 | v12.57,17.02 11.96,17.02 11.7,16.76 6.13,16.76 5.91,16.99 5.91,18.32 6.99,19.4 6.99,21.59 6.48,22.1 R24.1 | J6.3 19.26,44.2 18.23,45.23 14.98,45.23 14.76,45.01 14.76,43.38 16.89,41.25 U4.8 16.89,39.62 17.6,38.91 v18.16,38.91 | v15.62,37.47 C21.1
  Top 0.305: R8.1 7.96,28.11 Q2.2
  Top 0.381: L2.2 19.57,22.97 C9.2
  Top 0.508: C1.2 17.99,25.78 C9.2 C10.2 R7.2 | U1.3 12.83,16.76 v12.57,17.02 | v37.72,30.35 37.32,30.35 36.89,30.78 U6.44 37.04,30.5 C15.1 | U6.14 35.17,43.19 35.39,43.41 C17.1 | U6.24 25.67,39.78 C16.1 25.1,39.8 24.89,40.01 24.9,40.01 24.9,42.04 25.96,43.11 25.96,45.88 26.7,46.61 26.7,47.26 27.18,47.74 v27.18,48.13 | U6.34 28.49,30.5 C18.1 28.49,28.75 27.94,28.19 26.5,28.19 26.33,28.36 v26.29,28.32 | D2.- 37.2,45.47 35.43,43.7 35.43,43.69 | D2.-
  Top 0.635: J7.6 45.59,31.62 45.59,46.86 43.31,49.15 37.84,49.15 37,48.32 | 19.8,48.75 J6.3 | 37,48.32 R9.1 R10.2 37,45.8 D2.- | 37,48.32 35.92,49.4 30.71,49.4 30.2,48.9 28.42,48.9 27.85,48.32 27.37,48.32 v27.18,48.13
  Top 0.762: J2.2 10.41,4.06 14.99,4.06 J2.5 | v9.78,27.94 9.4,27.56 Q2.2 | v37.72,30.35 38.22,30.35 40.39,32.52 43.3,32.52 44.45,31.38 J7.6 | v19.81,48.77 19.8,48.75
  Top 1.016: v26.29,28.32 v26.29,27.18
  Top 1.143: v19.56,26.04 21.46,26.04 | 21.46,26.04 22.1,26.67 22.1,28.97 22.66,29.53 24.59,29.53 25.8,28.32 v26.29,28.32 | 21.46,26.04 19.56,24.13
  Bottom 0.254: v18.16,38.91 16.71,37.47 v15.62,37.47
  Bottom 0.508: v9.78,27.94 v9.78,26.8
  Bottom 0.635: v27.18,48.13 26.54,48.77 v19.81,48.77 8.38,48.77 7.35,47.74 J8.3
  Bottom 0.762: J2.2 7.75,3.68 7.75,6.22 8.51,6.99 11.56,6.99 12.45,7.87 12.45,13.97 12.57,14.1 v12.57,14.73 v12.57,15.88 v12.57,17.02 | v37.72,30.35 37.47,30.61 27.34,30.61 26.29,29.56 v26.29,28.32
  Bottom 1.016: v26.29,28.32 v26.29,27.18
  other vias: 18.41,24.89 19.56,24.89
  pour Top (no thermals): 12.06,18.54 12.06,14.73 12.57,14.22 13.72,14.22 15.88,16.38 15.88,17.53 17.91,19.56 20.32,19.56 20.45,19.68 20.45,26.29 20.19,26.54 12.19,26.54 12.06,26.42 12.06,25.4 12.32,25.15 13.21,25.15 13.97,24.38 16.13,24.38 16.38,24.13 16.38,19.56 15.88,19.05 12.57,19.05
  pour Top (no thermals): 8.45,27.37 9.53,26.29 10.03,26.29 10.29,26.54 10.29,28.19 10.03,28.45 9.53,28.45
  pour Bottom (no thermals): 10.67,25.15 9.27,26.54 9.27,28.07 9.53,28.32 10.03,28.32 11.81,26.54 19.81,26.54 20.07,26.29 20.07,24.64 19.81,24.38 13.97,24.38 13.21,25.15
_ACT
  Top 0.254: R25.2 2.12,24.93 2.12,24.97 2.41,25.27 2.45,25.27 3.05,25.86 D4.+ 4.19,25.91 5.84,24.26 D5.+
_D13
  Top 0.254: D6.+ 3.05,28.4 2.45,27.81 2.41,27.81 2.12,27.51 2.12,27.47 R26.2
_PWR
  Top 0.254: D3.+ 3.05,23.32 2.45,22.73 2.41,22.73 2.12,22.43 2.12,22.39 R24.2
ACT_LED  (via drill 0.3 pad 0.64)
  Top 0.254: U5.22 30.27,40.22 28.77,41.72 U6.22 27.6,42.38 v27.56,42.42 | R25.1 v3.81,24.64 4.76,23.69 4.76,23.02 4.99,22.8 6.7,22.8 6.92,23.02 6.92,24.73 6.7,24.96 5.86,24.96 4.7,26.12 4.7,28.59 6.99,30.87 6.99,32.13 v6.86,32.26
  Bottom 0.254: v27.56,42.42 27.47,42.33 26.6,42.33 26.3,42.04 10.51,42.04 6.78,38.31 6.78,32.34 v6.86,32.26
AT_MISO  (via drill 0.3 pad 0.64)
  Top 0.254: U5.11 36.42,39.08 37.92,40.58 U6.11 39.81,40.58 v41.27,42.04 | R15.1 29.05,24.89 29.68,25.52 31.11,25.52 31.62,26.03 32.95,26.03 33.45,26.54 40.43,26.54 40.7,26.82 40.7,28.44 41.91,29.65 J7.1
  Bottom 0.254: J7.1 43.94,32.51 43.94,37.65 42.16,39.43 42.16,39.99 41.27,40.88 v41.27,42.04
AT_MOSI  (via drill 0.3 pad 0.64)
  Top 0.254: U5.10 36.72,38.58 37.92,39.78 U6.10 39.73,39.78 40.85,40.89 42.29,40.89 v42.42,41.02 | R16.1 26.62,24.89 27.26,25.52 28.96,25.52 29.47,26.03 30.9,26.03 31.41,26.54 32.73,26.54 33.24,27.05 39.38,27.05 v39.76,27.43
  Bottom 0.254: v39.76,27.43 40.34,27.43 41.03,26.73 43.24,26.73 J7.5 44.45,28.77 43.24,29.98 43.24,30.98 43.95,31.69 44.01,31.69 44.45,32.13 44.45,37.86 42.67,39.64 42.67,40.2 42.42,40.46 v42.42,41.02
AT_SCK  (via drill 0.3 pad 0.64)
  Top 0.254: U5.9 37.02,38.08 37.92,38.98 U6.9 40.01,38.99 40.64,39.62 v41.27,39.62 | J7.2 41.91,27.18 40.76,26.03 33.66,26.03 33.16,25.52 31.84,25.52 31.21,24.89 R17.1
  Bottom 0.254: J7.2 41.91,28.29 40.7,29.5 40.7,31.46 40.93,31.69 42.4,31.69 43.43,32.72 43.43,37.44 41.27,39.6 v41.27,39.62
AT_SS  (via drill 0.3 pad 0.64)
  Top 0.254: U5.8 37.32,37.58 37.92,38.18 U6.8 39.32,38.18 39.62,38.48 41.39,38.48 42.91,40.01 v43.56,40.01 43.56,39.98 44.39,39.16 44.39,34.17 43.87,33.66 41.72,33.66 v41.59,33.53 | R18.1 26.12,5.26 26.93,4.45 38.01,4.45 39.01,5.45 39.01,8.4 38.78,8.62 37.82,8.62 37.55,8.89 37.55,9.57 36.96,10.16 36.96,10.65 36.44,11.18 35.81,11.18 v35.69,11.3
  Bottom 0.254: v35.69,11.3 35.69,12.21 35.94,12.46 35.94,13.2 35.69,13.45 35.69,26.05 38.99,29.35 38.99,31.9 40.3,33.21 41.27,33.21 v41.59,33.53
BOOT_MODE
  Top 0.254: R23.1 R27.2 30.31,6.96 U3.18
D+  (via drill 0.3 pad 0.64)
  Top 0.254: U5.4 37.32,35.58 37.92,34.98 U6.4 39.8,34.98 v40.01,35.18 | R3.2 12.15,34.97 v12.19,34.92
  Bottom 0.254: v12.19,34.92 12.14,34.92 10.79,36.27 10.79,38.59 12.71,40.51 34.59,40.51 39.92,35.18 v40.01,35.18
D-  (via drill 0.3 pad 0.64)
  Top 0.254: U5.3 37.02,35.08 37.92,34.18 U6.3 40.27,34.18 v41.15,35.05 | R2.2 12.15,37.51 v11.68,37.97
  Bottom 0.254: v41.15,35.05 41.13,35.05 40.5,34.42 39.51,34.42 38.99,34.94 38.99,35.39 38.84,35.54 38.65,35.54 38.48,35.37 38.48,35.18 38.35,35.05 38.1,35.05 37.97,35.18 37.97,36.41 34.38,40.01 12.95,40.01 11.68,38.73 v11.68,37.97
ESP_EN  (via drill 0.3 pad 0.64)
  Top 0.254: R14.2 34.02,24.45 U3.3 34.02,21.83 33.66,21.46 v28.7,21.46 | v27.43,29.08 27.43,32.53 | U6.33 26.92,32.53 27.43,32.53 | U5.33 29.12,34.08 27.58,32.53 27.43,32.53
  Bottom 0.254: v27.43,29.08 27.43,22.73 v28.7,21.46
GND  (via drill 0.3 pad 0.64)
  Top 0.254: v30.86,34.67 30.77,34.58 U5.35 30.77,32.63 29.57,31.43 U6.35 | v34.67,34.67 34.77,34.58 U5.43 34.77,32.63 35.97,31.43 U6.43 | U6.23 27.62,40.58 29.12,39.08 U5.23 30.07,39.06 30.66,38.48 | C12.1 C13.1 33.57,47.92 34.16,48.51 35.06,48.51 v35.69,47.88 v35.69,46.74 v35.69,45.59 35.69,44.95 34.46,43.73 C17.2 34.37,43.59 U6.15 34.37,41.73 33.77,41.13 U5.15 33.77,38.75 v34.04,38.48 | U2.4 11.64,22.15 v11.63,22.16 | U3.15 24.02,6.45 23.29,5.71 R20.1 | C19.2 37.04,28.5 36.11,29.42 C15.2 | C21.2 16.07,35.73 16.51,36.18 19.81,36.18 20.7,35.29 U4.4
  Top 0.381: J1.GND2 J1.GND4 J1.GND3 J1.GND1
  Top 0.508: C1.1 17.99,27.56 C9.1 C10.1 R6.1 | USB1.S6 5.77,34.04 L1.1 7.87,33.96 9.27,32.57 9.27,30.31 9.87,29.72 11.43,29.72 v12.19,28.96 | C15.2 36.11,29.82 36.01,29.93 36.01,30.46 36,30.46 36,30.74 U6.43 | U6.35 29.57,29.61 C18.2
  Top 0.889: v38.35,21.21 v38.35,20.07
  Top 1.016: J2.7 J2.6 | J1.CDN1 J1.CDN2 J1.CDN3 J1.CDN4
  Bottom 0.762: J7.4 42.99,23.94 38.86,23.94 38.35,23.43 v38.35,21.21 v38.35,20.07
  other vias: 12.78,21.66 20.7,18.16 20.7,16.13 13.34,28.96 14.48,28.96 15.62,28.96 20.83,28.83 20.83,27.3 19.43,27.3 24.51,8.89 21.97,7.37 22.61,6.6 22.23,51.18 25.6,32 31.5,38.48 26.42,31.31 25.6,30.61 12.19,43.05 12.19,44.32 22.35,46.23 18.8,46.23 16.89,46.23 4.06,47.24 8.38,47.24 7.37,40.77 45.34,51.69 44.07,51.69 43.05,46.61 43.05,47.75 43.56,43.94 20.83,46.23 22.23,50.04 6.1,40.77 6.1,42.55 8.38,43.31 37.59,43.43 28.83,19.68 30.1,19.68 31.37,19.68 38.35,9.78 38.35,10.92 38.35,12.06 27.18,21.46 28.19,26.29 25.65,21.46 43.56,42.67 13.21,38.99 28.19,18.92 27.56,19.68 31.37,18.16 24.51,10.41 25.15,9.65 25.53,26.04 28.83,18.16 28.19,17.4 28.83,16.64 29.46,17.4 30.1,18.16 11.43,30.61 12.57,30.61 13.72,30.61 14.86,30.61 13.21,33.53 26.04,3.3 29.97,9.02 30.86,13.41 38.35,18.92 38.35,17.78 38.35,16.64 38.35,15.49 38.35,14.35 38.35,13.21 29.46,18.92 30.73,18.92 30.73,17.4 30.1,16.64 31.37,16.64 30.73,15.88 29.21,27.3 38.61,43.43 12.78,22.67 1.14,17.27 1.14,19.3 0.76,29.72 1.14,18.29 3.17,18.8 29.46,15.88 30.1,15.11 31.37,15.11 3.17,17.78 30.86,37.72 32.77,38.48 32.13,37.72 33.4,37.72 32.13,34.67 34.67,37.72 34.04,36.96 32.77,36.96 31.5,36.96 30.86,36.2 32.13,36.2 33.4,36.2 34.67,36.2 31.5,35.43 32.77,35.43 34.04,35.43 33.4,34.67 26.54,26.04 28.19,27.3 12.19,33.53 13.59,35.81 6.73,41.66 13.59,37.21 9.27,41.91 20.13,28.07 20.7,17.14 25.78,8.89 22.61,8.13 21.97,8.89 21.97,5.84 23.24,8.89 27.3,2.16 27.3,3.3 26.04,2.16 10.29,30.61 11.05,28.96 4.32,46.23
  pour Top (rank 2, no thermals): 8.38,20.57 8.13,20.83 8.13,23.62 8.38,23.88 12.83,23.88 13.21,23.5 13.21,21.72 12.06,20.57
  pour Top (no thermals): 1.14,13.59 1.14,6.35 2.29,5.21 13.21,5.21 13.97,5.97 13.97,7.87 11.56,10.29 11.56,16.38 6.35,16.38 6.35,14.99 6.1,14.73 2.29,14.73
  pour Bottom (no thermals): 0.76,4.83 0.25,5.33 0.25,14.22 0.76,14.73 3.43,14.73 4.06,15.37 4.06,17.78 4.83,18.54 6.35,18.54 7.6,19.8 7.6,23.86 7.87,24.13 13.08,24.13 13.34,23.88 13.34,21.59 11.68,19.94 11.68,8.38 10.92,7.62 8.26,7.62 7.11,6.48 7.11,5.33 6.6,4.83
  pour Top (no thermals): 12.06,26.92 11.56,27.43 11.56,29.34 11.81,29.59 20.45,29.59 21.21,28.83 21.21,27.18 20.95,26.92
  pour Bottom: 12.19,23.75 7.62,23.75 7.62,28.32 8.89,29.59 16,29.59 16.51,29.08 16.51,28.57 16.13,28.19 10.79,28.19 10.29,28.7 9.4,28.7 8.89,28.19 8.89,26.42 10.54,24.77 12.32,24.77 12.45,24.64 12.45,24
  pour Bottom: 13.46,20.32 13.46,16.13 13.72,15.88 20.57,15.88 21.59,14.86 21.59,5.71 21.84,5.46 22.35,5.46 22.61,5.71 22.61,15.24 21.21,16.64 21.21,28.83 20.7,29.34 19.43,29.34 19.05,28.96 19.05,27.18 19.3,26.92 19.94,26.92 20.45,26.42 20.45,24.51 19.94,24 14.73,24 14.22,23.5 14.22,21.08
  pour Top (no thermals): 0.38,39.75 0.38,32.38 0.89,31.88 4.83,31.88 5.08,32.13 5.08,40.01 4.83,40.26 0.89,40.26
  pour Bottom (no thermals): 24,38.86 24,36.32 25.02,35.31 25.02,30.99 25.27,30.73 25.91,30.73 27.3,32.13 35.81,32.13 36.32,32.64 36.32,36.96 34.04,39.24 24.38,39.24
  pour Bottom (no thermals): 0.76,15.11 0,15.88 0,52.32 1.02,53.34 45.97,53.34 46.99,52.32 46.99,1.02 45.97,0 27.3,0 21.59,5.71 21.59,14.86 20.7,15.75 13.84,15.75 13.46,16.13 13.46,18.67 14.25,19.46 14.25,23.52 14.73,24 19.94,24 20.45,24.51 20.45,26.42 19.94,26.92 19.3,26.92 19.05,27.18 19.05,28.96 18.67,29.34 16.64,29.34 16,29.97 8.76,29.97 7.24,28.45 7.24,19.94 6.22,18.92 4.7,18.92 3.68,17.91 3.68,15.49 3.3,15.11
  pour Top (rank 6, no thermals): 0,5.21 0,1.02 1.02,0 36.32,0 46.99,10.67 46.99,52.32 45.97,53.34 1.02,53.34 0,52.32 0,15.11 3.56,15.11 3.68,15.24 3.68,18.16 4.06,18.54 5.71,18.54 7.11,19.94 7.11,25.91 7.75,26.54 20.57,26.54 20.83,26.29 20.83,19.18 20.45,18.8 18.29,18.8 17.4,17.91 17.4,15.88 18.67,14.61 20.32,14.61 20.7,14.22 20.7,5.97 18.16,3.43 8.26,3.43 6.48,5.21
GPIO2_LED  (via drill 0.3 pad 0.64)
  Top 0.254: v25.4,12.06 28.02,9.44 U3.17 28.02,6.38 27.48,5.83 R29.2 | v6.1,31.24 3.3,31.24 D7.-
  Bottom 0.254: v25.4,12.06 25.4,14.3 22.14,17.56 22.14,33.87 20.95,35.05 15.99,35.05 13.45,32.51 9.64,32.51 8.5,31.37 6.22,31.37 v6.1,31.24
N$1
  Top 0.203: ESD1.3 8.94,36.63 5.84,36.63 5.7,36.72 USB1.2
  Top 0.254: ESD1.3 10.83,37.35 R2.1
N$2
  Top 0.203: USB1.3 5.63,36.07 5.76,36.2 9.06,36.2 ESD1.2
  Top 0.254: R3.1 10.83,35.55 ESD1.2
N$3
  Top 0.305: R8.2 7.03,27.77 7.21,27.58 7.22,27.58 7.49,27.31 7.49,26.67 8.38,25.78 Q2.1
N$4
  Top 0.254: R28.2 1.52,30.02 D7.+
N$5
  Top 0.254: R19.2 32.18,23.39 U3.4
N$9
  Top 0.254: 7.79,37.37 ESD1.4
  Top 0.406: USB1.1 7.79,37.37 | F1.1 7.37,37.8 ESD1.4
N$12
  Top 0.254: R15.2 27.61,24.46 28.02,24.05 U3.6
N$13
  Top 0.254: R11.2 C14.1
N$14
  Top 0.254: U3.7 26.04,23.25 26.04,23.75 26.16,23.88 25.57,24.46 R16.2
N$15
  Top 0.254: R4.2 C8.2
N$17
  Top 0.254: R21.1 38.18,7.08 U3.22
N$18
  Top 0.254: R22.1 35.9,7.11 U3.21
N$19
  Top 0.254: R17.2 U3.5
N$20
  Top 0.254: R20.2 R18.2 25.19,6.01 26.02,6.85 U3.16
N$22
  Top 0.254: U3.1 38.02,24.41 R13.2
N$23
  Top 0.305: R5.2 10.24,25.61 10.41,25.78 R7.1
  Top 0.508: R6.2 R7.1
PIN_A0  (via drill 0.3 pad 0.64)
  Top 0.254: U5.36 31.27,32.33 30.37,31.43 U6.36 30.37,28.84 v30.23,28.7
  Bottom 0.254: v30.23,28.7 30.23,28.38 32.13,26.48 32.13,14.76 31.62,14.25 31.62,11.41 32.13,10.9 32.13,10.14 32.64,9.63 32.64,7.6 33.27,6.96 33.27,4.83 32.26,3.81 30.48,3.81 J3.1
PIN_A1  (via drill 0.3 pad 0.64)
  Top 0.254: U5.37 31.77,32.03 31.17,31.43 U6.37 31.17,29.38 v31.13,29.34
  Bottom 0.254: J3.2 33.78,4.57 33.78,7.17 33.15,7.81 33.15,9.84 32.64,10.35 32.64,11.11 32.13,11.62 32.13,14.04 32.64,14.54 32.64,26.8 31.13,28.31 v31.13,29.34
PIN_A2  (via drill 0.3 pad 0.64)
  Top 0.254: U5.38 32.27,31.73 31.97,31.43 U6.38 31.97,28.74 v32,28.7
  Bottom 0.254: v32,28.7 32.01,28.19 33.15,27.05 33.15,14.34 32.64,13.83 32.64,11.83 33.15,11.32 33.15,10.56 33.66,10.05 33.66,8.02 34.29,7.38 J3.3
PIN_A3  (via drill 0.3 pad 0.64)
  Top 0.254: U5.39 U6.39 v32.77,29.34
  Bottom 0.254: v32.77,29.34 32.77,28.22 33.66,27.33 33.66,14.12 33.15,13.62 33.15,12.04 33.66,11.53 33.66,10.77 34.16,10.26 34.16,8.23 34.8,7.59 34.8,4.57 J3.4
PIN_A4  (via drill 0.3 pad 0.64)
  Top 0.254: U5.40 33.27,31.73 33.57,31.43 U6.40 33.57,28.74 v33.59,28.71
  Bottom 0.254: J3.5 38.16,3.75 36.34,3.75 35.31,4.78 35.31,7.8 34.67,8.44 34.67,10.47 34.16,10.98 34.16,11.74 33.66,12.25 33.66,13.41 34.16,13.91 34.16,27.61 33.59,28.19 v33.59,28.71
PIN_A5  (via drill 0.3 pad 0.64)
  Top 0.254: U5.41 33.77,32.04 33.78,32.03 34.37,31.43 U6.41 34.37,29.38 v34.42,29.34
  Bottom 0.254: v34.42,29.34 34.42,28.08 34.67,27.83 34.67,13.7 34.16,13.2 34.16,12.46 34.67,11.95 34.67,11.19 35.18,10.68 35.18,8.65 35.81,8.01 35.81,5.02 36.58,4.25 38.37,4.25 38.88,3.75 39.87,3.75 41.08,2.54 J3.6
PIN_AREF  (via drill 0.3 pad 0.64)
  Top 0.254: U5.42 34.27,32.33 35.17,31.43 U6.42 35.18,30.76 35.18,29.38 C19.1 v35.18,28.45 | J4.8 7.6,45.74 9.99,45.74 11.3,44.42 11.3,42.69 11.82,42.16 13.11,42.16 14.69,40.59 14.69,38.51 v14.99,38.21 | v35.05,12.83 33.66,14.22 29.59,14.22 25.02,18.8 v24.89,18.8
  Bottom 0.254: v24.89,18.8 23.67,20.02 23.67,34.65 21.74,36.58 15.42,36.58 14.88,37.11 14.88,37.77 14.99,37.87 v14.99,38.21 | v35.18,28.45 35.18,12.95 v35.05,12.83
PIN_D0  (via drill 0.3 pad 0.64, 0.35)
  Top 0.254: U5.20 31.27,40.83 30.37,41.73 U6.20 30.35,42.39 30.35,43.05 28.96,44.45 v28.83,44.45 | R21.2 37.26,5.87 37.04,6.08 37.04,9.19 v36.07,10.16 32.93,10.16 26.84,16.26 26.18,16.26 v24.89,17.53 | J8.1 3.89,44.2 4.92,45.23 9.78,45.23 10.79,44.22 10.79,42.47 11.61,41.66 12.9,41.66 14.18,40.38 14.18,37.98 14.61,37.55 v14.61,36.07
  Bottom 0.254: J5.1 41.53,50.42 41.53,44.37 39.71,42.55 39.5,42.34 v39.5,41.66 | v24.89,17.53 23.16,19.28 23.16,34.44 21.53,36.07 v14.61,36.07 | v28.83,44.45 28.83,43.63 29.92,42.55 35.43,42.55 36.32,41.66 v39.5,41.66 | v36.07,10.16 36.07,10.17 36.45,10.55 36.45,13.41 36.2,13.66 36.2,25.84 39.5,29.14 39.5,31.69 40.51,32.7 41.95,32.7 42.42,33.17 42.42,36.51 39.5,39.42 v39.5,41.66
PIN_D1  (via drill 0.3 pad 0.64)
  Top 0.254: U5.21 30.77,40.53 29.57,41.73 U6.21 29.57,43.12 29.13,43.56 28.21,43.56 27.57,44.2 v27.56,44.2 | J8.2 5.71,44.2 9.65,40.26 10.95,40.26 11.18,40.04 11.18,39.12 11.56,38.73 12.05,38.73 12.78,38.01 12.78,35.42 13.91,34.29 v13.97,34.29 | R22.2 34.97,6.05 35.04,6.12 35.04,8.4 35.27,8.62 35.67,8.62 v36.07,9.02 33.36,9.02 26.63,15.75 25.4,15.75 v24.89,16.26
  Bottom 0.254: v24.89,16.26 22.65,18.5 22.65,34.23 21.32,35.56 15.24,35.56 v13.97,34.29 | v27.56,44.2 27.56,44.53 28.36,45.34 29.2,45.34 29.72,44.82 29.72,43.56 30.23,43.05 35.64,43.05 36.44,42.25 38.7,42.25 41.02,44.58 41.02,49.15 J5.2 39.72,50.8 40.93,52.01 42.89,52.01 43.12,51.78 43.12,49.44 42.04,48.36 42.04,44.16 40.26,42.38 40.26,39.38 42.93,36.72 42.93,32.96 42.16,32.19 40.72,32.19 40.01,31.48 40.01,28.93 36.7,25.63 36.7,13.87 36.96,13.62 36.96,9.92 v36.07,9.03 v36.07,9.02
PIN_D2_SDA  (via drill 0.3 pad 0.64)
  Top 0.254: U5.19 31.77,41.13 31.17,41.73 U6.19 31.17,43.17 29.72,44.62 29.72,45.21 v28.7,46.23 | U3.19 32.02,8.51 v27.2,13.34 | J6.2 20.7,41.29 U4.5 v20.7,38.91
  Bottom 0.254: J5.3 36.07,50.8 34.16,48.9 31.59,48.9 30.4,47.71 30.23,47.54 30.23,47 29.45,46.23 v28.7,46.23 28.25,46.23 25.18,43.16 18.86,43.16 17.82,44.2 J6.2 | v27.2,13.34 27.2,18.52 24.68,21.04 24.68,35.12 22.21,37.59 21.59,37.59 20.7,38.48 v20.7,38.91
PIN_D3_SCL  (via drill 0.3 pad 0.64)
  Top 0.254: U5.18 32.27,41.43 31.97,41.73 U6.18 31.97,43.09 30.23,44.83 30.23,46.6 29.45,47.37 v29.34,47.37 | J6.1 15.8,44.15 17.53,42.42 18.29,42.42 19.43,41.27 U4.6 v19.43,38.91 | v26.16,14.86 26.8,14.86 34.02,7.63 U3.20
  Bottom 0.254: J6.1 16.83,45.23 26.44,45.23 28.58,47.37 v29.34,47.37 31.38,49.4 33.78,49.4 34.29,49.91 J5.4 | v26.16,14.86 26.16,18.8 24.17,20.79 24.17,34.91 22,37.08 21.21,37.08 v19.43,38.91
PIN_D4
  Top 0.254: U5.25 28.52,38.08 27.62,38.98 U6.25 26.8,39.14 24.86,39.14 24.26,39.74 24.26,42.32 25.3,43.36 25.3,46.11 26.06,46.88 26.06,47.61 25.71,47.96 25.71,48.33 26.41,49.02 27.56,49.02 28.13,49.59 29.91,49.59 31.11,50.8 J5.5
PIN_D5  (via drill 0.3 pad 0.64)
  Top 0.254: U5.31 28.52,35.08 27.62,34.18 U6.31 25.84,34.18 v25.58,34.44 | v23.75,38.08 23.75,38.79 23.24,39.3 23.24,42.74 24.28,43.78 24.28,47.61 26.2,49.53 27.35,49.53 27.92,50.1 28.51,50.1 J5.6
  Bottom 0.254: v25.58,34.44 25.58,36.25 v23.75,38.08
PIN_D6
  Top 0.254: U5.27 27.92,37.08 27.62,37.38 U6.27 24.3,37.38 24.12,37.19 23.38,37.19 22.86,37.71 22.86,38.96 22.73,39.09 22.73,42.95 23.77,43.99 23.77,47.9 J5.7
PIN_D7  (via drill 0.3 pad 0.64)
  Top 0.254: U5.1 36.42,34.08 37.92,32.58 U6.1 v36.77,32.58 v36.76,32.57 | J5.8 23.21,49.88 23.21,44.15 22.23,43.16 22.23,38.84 v21.97,38.59
  Bottom 0.254: v36.76,32.57 36.76,36.91 34.19,39.48 22.86,39.48 v21.97,38.59
PIN_D8
  Top 0.254: U5.28 U6.28 23.24,36.58 22.12,37.7 18.07,37.7 16.21,39.56 16.21,41.22 14.25,43.17 14.25,45.22 19.84,50.8 J4.1
PIN_D9
  Top 0.254: U5.29 27.92,36.08 27.62,35.78 U6.29 26.25,35.78 26.09,35.95 23.15,35.95 21.91,37.19 17.86,37.19 15.7,39.35 15.7,41.01 13.74,42.96 13.74,45.43 13.75,45.43 17.78,49.46 J4.2
PIN_D10
  Top 0.254: U5.30 28.22,35.58 27.62,34.98 U6.30 26.34,34.98 25.88,35.44 22.94,35.44 21.7,36.68 17.65,36.68 15.19,39.14 15.19,40.8 13.24,42.75 13.24,45.64 15.24,47.64 J4.3
PIN_D11  (via drill 0.3 pad 0.64)
  Top 0.254: U5.12 35.27,40.23 36.77,41.73 U6.12 36.77,41.03 v36.94,40.86 | J4.4 11.81,49.91 v11.81,47.24
  Bottom 0.254: v36.94,40.86 36.4,40.86 35.22,42.04 29.7,42.04 28.43,43.31 26.86,43.31 26.09,42.55 15.37,42.55 11.81,46.1 v11.81,47.24
PIN_D12  (via drill 0.3 pad 0.64)
  Top 0.254: U5.26 28.22,37.58 27.62,38.18 U6.26 25.08,38.18 23.75,39.51 23.75,42.53 24.79,43.57 24.79,46.86 v25.17,47.24 | v13.34,47.24 13.32,47.24 12.43,46.35 11.44,46.35 10.16,47.64 J4.5
  Bottom 0.254: v25.17,47.24 v13.34,47.24
PIN_D13  (via drill 0.3 pad 0.64)
  Top 0.254: U5.32 28.82,34.58 27.62,33.38 U6.32 21.36,33.38 v21.21,33.53 | R26.1 v3.81,27.18 | R27.1 29.38,5.74 29.04,6.08 29.04,9.69 24.77,13.97 v24.38,13.97
  Bottom 0.254: J4.6 5.91,49.09 4.72,49.09 1.66,46.02 1.66,42.27 2.9,41.02 4.66,41.02 6.19,39.48 6.19,33.09 5.21,32.1 5.21,30.62 | v24.38,13.97 21.63,16.73 21.63,33.11 v21.21,33.53 20.19,34.54 16.2,34.54 13.66,32 9.85,32 8.71,30.86 6.97,30.86 6.46,30.35 5.47,30.35 | 5.47,30.35 5.21,30.62 | 5.21,30.09 5.21,29.14 3.81,27.74 v3.81,27.18 | 5.21,30.09 5.21,30.62 | 5.47,30.35 5.21,30.09
RESET  (via drill 0.3 pad 0.64)
  Top 0.254: U5.13 34.77,40.53 35.97,41.73 U6.13 35.97,43.08 37.21,44.32 39.88,44.32 40.64,45.09 D2.+ | R10.1 37.97,47.03 C11.1 R11.1 41.02,46.74 40.64,46.35 D2.+ | R19.1 33.24,24.89 33.87,25.52 41.79,25.52 J7.3 | D2.+ 42.8,45.47 v43.05,45.21
  Bottom 0.254: J2.3 11.43,2.48 12.71,1.21 42.66,1.21 43.24,1.79 43.24,3.17 42.54,3.87 40.58,3.87 40.13,4.32 39.03,4.32 38.58,4.76 36.79,4.76 36.32,5.23 36.32,8.01 36.96,8.65 36.96,9.2 37.47,9.71 37.47,13.83 37.21,14.08 37.21,23.75 38.86,25.4 J7.3 42.74,26.23 43.45,26.23 43.96,26.73 44.95,26.73 45.66,27.44 45.66,39.17 42.55,42.28 42.55,44.7 v43.05,45.21
RSTAT  (via drill 0.3 pad 0.64)
  Top 0.254: R9.2 38.94,48.01 C11.2 39.03,48.01 v40.01,48.01 | SW1.2 2.56,20.57 v4.32,20.57 D5.-
  Bottom 0.254: v4.32,20.57 4.32,22.87 2.92,24.27 2.92,26.09 2.41,26.6 2.41,27.78 3.46,28.83 4.18,28.83 4.7,29.35 4.7,32.44 5.64,33.38 5.64,39.32 4.45,40.51 2.67,40.51 1.15,42.03 1.15,46.23 4.51,49.59 5.58,49.59 6.41,50.43 6.41,51.3 7.27,52.15 37.18,52.15 38.16,51.17 38.16,50.3 40.01,48.46 v40.01,48.01
SW_BS
  Top 0.254: R4.1 13.46,23.7 13.25,23.5 11.67,23.5 U2.5
SW_EN  (via drill 0.3 pad 0.64)
  Top 0.254: v12.57,18.54 12.06,19.05 R1.1 | v12.83,24.38 12.12,24.38 12,24.51 11.29,24.51 11.06,24.28 11.06,23.59 U2.6
  Bottom 0.305: v12.57,18.54 12.57,20.19 13.72,21.34 13.72,23.5 v12.83,24.38
SW_FB
  Top 0.254: R5.1 9.69,24.6 U2.8
SW_SS
  Top 0.254: C7.2 8.94,20.75 9.11,20.93 U2.1
SW_VCAP
  Top 0.254: C5.2 8.51,23.7 9.11,23.1 9.11,22.77 9.34,22.54 10.05,22.54 10.34,22.84 U2.7
SW_VCC_IN
  Top 0.305: 10.34,20 10.34,19.17 R1.2 10.46,18.12 C3.2
  Top 0.381: 10.34,20 U2.2
  Top 0.508: Q1.2 C2.2 C3.2
  pour Top (no thermals): 11.56,17.14 6.35,17.14 6.35,18.16 8.13,19.94 10.03,19.94 10.29,20.19 10.49,20.19 10.49,19.43 11.56,18.29
SW_VCC_OUT
  Top 0.381: U2.3 11,20.14 11.26,19.88 12.03,19.88 12.89,20.75 C8.1 14,20.75 L2.1
  pour Top (no thermals): 10.85,20.19 10.85,19.72 11.07,19.43 15.75,19.43 16,19.68 16,21.34 15.75,21.59 14.48,21.59 13.84,20.95 12.95,20.95 12.19,20.19
UCAP
  Top 0.254: U5.6 U6.6 40.13,36.58 40.66,37.1 41.77,37.1 41.85,37.02 C20.2
UGND  (via drill 0.3 pad 0.64)
  Top 0.254: U5.5 37.62,36.08 37.92,35.78 U6.5 39.22,35.78 39.38,35.94 40.75,35.94 41.02,36.21 v41.15,36.21 41.64,36.21 42.29,35.56 42.48,35.56 C20.1
  Top 0.406: USB1.5 6.07,34.77 6.85,35.55 ESD1.1 8.14,35.55 8.84,34.85 | 8.84,34.85 | 8.84,34.85 L1.2 v11.18,34.04
  Bottom 0.254: v11.18,34.04 11.17,34.04 10.29,34.92 10.29,38.81 12.5,41.02 34.8,41.02 39.62,36.2 41.13,36.2 v41.15,36.21
VIN  (via drill 0.3 pad 0.64)
  Top 0.508: J1.VCC2 J1.VCC1
  Top 1.016: Q1.3 4.83,14.99 4.08,14.24 2.05,14.24 1.02,13.21 1.02,6.73 2.19,5.56 9.36,5.56 J1.VCC4 | J1.VCC4 J1.VCC3 J1.VCC1 | J1.VCC4 J1.VCC2
  Bottom 1.016: J2.8 22.35,4.32 18.03,4.32 v16.76,5.59 | 10.99,5.59 J1.VCC1
  Bottom 1.27: 10.99,5.59 v16.76,5.59 v16.76,6.73 v16.76,7.87
  pour Top (no thermals): 16.13,8.13 16.13,5.33 16.38,5.08 17.4,5.08 18.29,5.97 18.29,8 17.78,8.51 16.51,8.51
VUSB  (via drill 0.3 pad 0.64)
  Top 0.254: U5.7 37.62,37.08 37.92,37.38 U6.7 39.8,37.38 v40.01,37.59 40.38,37.97 43.54,37.97 43.88,37.66 43.88,34.51 43.66,34.29 41.1,34.29 40.48,33.67 39.64,33.67 39.34,33.38 U6.2 37.92,33.38 36.72,34.58 U5.2
  Top 0.508: F1.2 v8.76,38.99 | Q2.3 6.48,27.3 6.1,27.69 6.1,29.08 8.13,31.11 v8.13,32.26
  Bottom 0.254: v40.01,37.59 38.95,37.59 35.01,41.53 11.28,41.53 8.76,39.02 v8.76,38.99
  Bottom 0.508: v8.76,38.99 8.13,38.35 v8.13,32.26
XTAL1
  Top 0.254: U5.17 U6.17 32.77,43.48 R12.2 32.56,44.23 X1.P$1 30.73,46.06 30.73,47.37 31.24,47.88 C12.2
XTAL2
  Top 0.254: U5.16 33.27,41.43 33.57,41.73 U6.16 33.57,43.6 R12.1 33.48,43.77 33.14,44.11 33.14,45.74 X1.P$3 34.5,47.1 C13.2

### Text on the board
Bottom: HW 1.0.0 Rev A / 16-01-2019
tNames: ESD1
silktop: ARF | GND | ~13 | 12 | ~11 | ~10 | ~9 | 8 | 7 | ~6 | ~5 | 4 | ~3 | 2 | T1 | R0 | UART | I2C | ECC / 608 | ICSP | ESP | 1 | D13 | ACT | ON | RESET | 5V | RST | 33V | 5V | -GND- | Vin | A0 | A1 | A2 | A3 | A4 | A5
silkbottom: RX | TX | VCC | GND | SCL | SDA | VCC | GND | Grove UART | Grove I2C | Adelino X2 / http://adelino.cc / Product Validation / Designed in Brazil | MISO | VCC | SCK | MOSI | RST | GND | DC IN | 7-15V